# Altium project AMC_FMC_Carrier v2.PrjPcb (part 8 of 9)

## Sheet JTAG_Configuration.SchDoc
size A4; DocumentNumber: 8; SheetNumber: 8; SheetTotal: 30
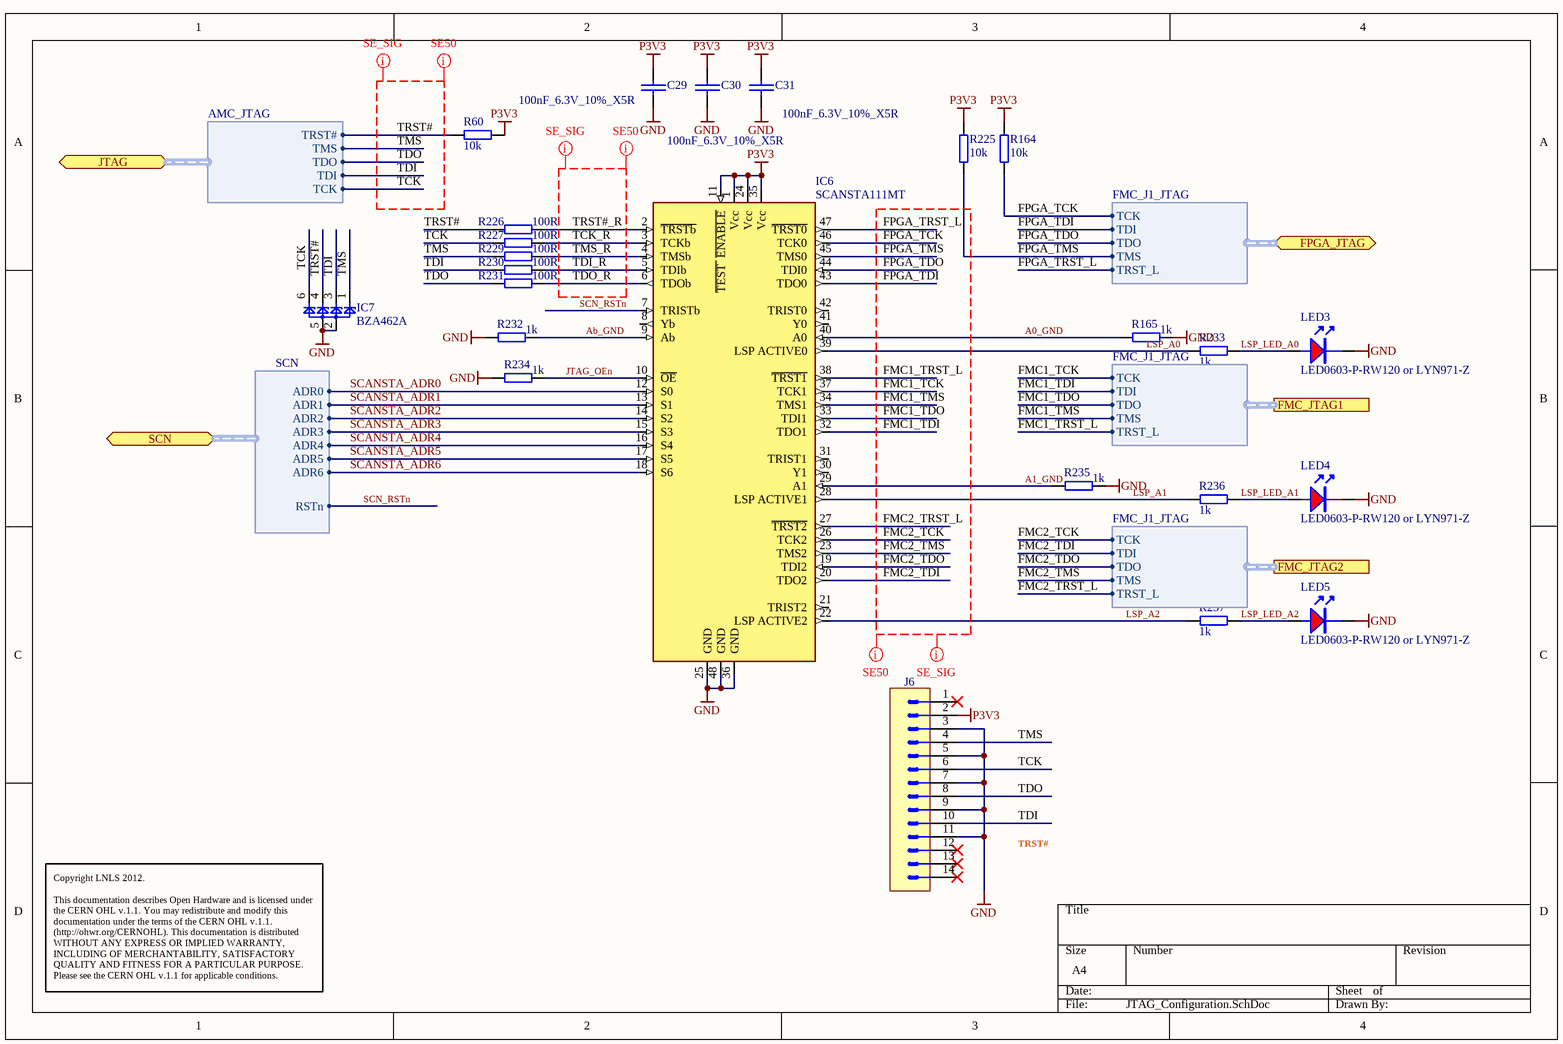
[diagram p16: JTAG_Configuration.SchDoc]

### Parts
C29  100nF_6.3V_10%_X5R  [0201C]
C30  100nF_6.3V_10%_X5R  [0201C]
C31  100nF_6.3V_10%_X5R  [0201C]
IC6  SCANSTA111MT  [TSSOP-48]
IC7  BZA462A  [SOT23-6]
J6  BHMT14S  [BHMT14S]  (value not drawn)
LED3  LED0603-P-RW120 or LYN971-Z  [led_0603R]
LED4  LED0603-P-RW120 or LYN971-Z  [led_0603R]
LED5  LED0603-P-RW120 or LYN971-Z  [led_0603R]
R60  10k  [0402R]
R164  10k  [0402R]
R165  1k  [0402R]
R225  10k  [0402R]
R226  100R  [0402R]
R227  100R  [0402R]
R229  100R  [0402R]
R230  100R  [0402R]
R231  100R  [0402R]
R232  1k  [0402R]
R233  1k  [0402R]
R234  1k  [0402R]
R235  1k  [0402R]
R236  1k  [0402R]
R237  1k  [0402R]

### Ports
FMC_JTAG1 (harness FMC_J1_JTAG), FMC_JTAG2 (harness FMC_J1_JTAG), FPGA_JTAG (harness FMC_J1_JTAG), JTAG (harness AMC_JTAG), SCN (harness SCN)

### Harnesses
FMC_J1_JTAG: TCK, TDI, TDO, TMS, TRST_L
AMC_JTAG: TCK, TDI, TDO, TMS, TRST#
SCN: ADR0, ADR1, ADR2, ADR3, ADR4, ADR5, ADR6, RSTn

### Nets
GND: C29.2 C30.2 C31.2 IC6.25(GND) IC6.36(GND) IC6.48(GND) IC7.2 IC7.5 J6.3 J6.5 J6.7 J6.9 J6.11 LED3.K LED4.K LED5.K R165.2 R232.1 R234.1 R235.2
P3V3: C29.1 C30.1 C31.1 IC6.1(Vcc) IC6.11(~{TEST_}_~{ENABLE}) IC6.24(Vcc) IC6.35(Vcc) J6.2 R60.1 R164.2 R225.2
A0_GND: IC6.40(A0) R165.1
A1_GND: IC6.29(A1) R235.1
Ab_GND: IC6.9(Ab) R232.2
FMC1_TCK: IC6.37(TCK1) ; port FMC_JTAG1.TCK  [project net JTAG1.TCK]
FMC1_TDI: IC6.32(TDO1) ; port FMC_JTAG1.TDI  [project net JTAG1.TDI]
FMC1_TDO: IC6.33(TDI1) ; port FMC_JTAG1.TDO  [project net JTAG1.TDO]
FMC1_TMS: IC6.34(TMS1) ; port FMC_JTAG1.TMS  [project net JTAG1.TMS]
FMC1_TRST_L: IC6.38(~{TRST1}) ; port FMC_JTAG1.TRST_L  [project net JTAG1.TRST_L]
FMC2_TCK: IC6.26(TCK2) ; port FMC_JTAG2.TCK  [project net JTAG2.TCK]
FMC2_TDI: IC6.20(TDO2) ; port FMC_JTAG2.TDI  [project net JTAG2.TDI]
FMC2_TDO: IC6.19(TDI2) ; port FMC_JTAG2.TDO  [project net JTAG2.TDO]
FMC2_TMS: IC6.23(TMS2) ; port FMC_JTAG2.TMS  [project net JTAG2.TMS]
FMC2_TRST_L: IC6.27(~{TRST2}) ; port FMC_JTAG2.TRST_L  [project net JTAG2.TRST_L]
FPGA_TCK: IC6.46(TCK0) R164.1 ; port FPGA_JTAG.TCK  [project net FJTAG.TCK]
FPGA_TDI: IC6.43(TDO0) ; port FPGA_JTAG.TDI  [project net FJTAG.TDI]
FPGA_TDO: IC6.44(TDI0) ; port FPGA_JTAG.TDO  [project net FJTAG.TDO]
FPGA_TMS: IC6.45(TMS0) R225.1 ; port FPGA_JTAG.TMS  [project net FJTAG.TMS]
FPGA_TRST_L: IC6.47(~{TRST0}) ; port FPGA_JTAG.TRST_L  [project net FJTAG.TRST_L]
JTAG_OEn: IC6.10(~{OE}) R234.2
LSP_A0: IC6.39(LSP_ACTIVE0) R233.1
LSP_A1: IC6.28(LSP_ACTIVE1) R236.1
LSP_A2: IC6.22(LSP_ACTIVE2) R237.1
LSP_LED_A0: LED3.A R233.2
LSP_LED_A1: LED4.A R236.2
LSP_LED_A2: LED5.A R237.2
SCANSTA_ADR0: IC6.12(S0) ; port SCN.ADR0  [project net SCN.ADR0]
SCANSTA_ADR1: IC6.13(S1) ; port SCN.ADR1  [project net SCN.ADR1]
SCANSTA_ADR2: IC6.14(S2) ; port SCN.ADR2  [project net SCN.ADR2]
SCANSTA_ADR3: IC6.15(S3) ; port SCN.ADR3  [project net SCN.ADR3]
SCANSTA_ADR4: IC6.16(S4) ; port SCN.ADR4  [project net SCN.ADR4]
SCANSTA_ADR5: IC6.17(S5) ; port SCN.ADR5  [project net SCN.ADR5]
SCANSTA_ADR6: IC6.18(S6) ; port SCN.ADR6  [project net SCN.ADR6]
SCN_RSTn: IC6.7(TRISTb) ; port SCN.RSTn  [project net SCN.RSTn]
TCK: IC7.6 J6.6 R227.1 ; port JTAG.TCK  [project net AJTAG.TCK]
TCK_R: IC6.3(TCKb) R227.2
TDI: IC7.3 J6.10 R230.1 ; port JTAG.TDI  [project net AJTAG.TDI]
TDI_R: IC6.5(TDIb) R230.2
TDO: J6.8 R231.1 ; port JTAG.TDO  [project net AJTAG.TDO]
TDO_R: IC6.6(TDOb) R231.2
TMS: IC7.1 J6.4 R229.1 ; port JTAG.TMS  [project net AJTAG.TMS]
TMS_R: IC6.4(TMSb) R229.2
TRST#: IC7.4 R60.2 R226.1 ; port JTAG.TRST#  [project net AJTAG.TRST#]
TRST#_R: IC6.2(~{TRSTb}) R226.2

Not connected (* = marked no-connect by the designer): IC6 8(Yb) 21(TRIST2) 30(Y1) 31(TRIST1) 41(Y0) 42(TRIST0); J6 1* 12* 13* 14*

### Layout directives
net class SE_SIG: FMC1_TCK, FMC1_TDI, FMC1_TDO, FMC1_TMS, FMC1_TRST_L, FMC2_TCK, FMC2_TDI, FMC2_TDO, FMC2_TMS, FMC2_TRST_L, FPGA_TCK, FPGA_TDI, FPGA_TDO, FPGA_TMS, FPGA_TRST_L, TCK, TCK_R, TDI, TDI_R, TDO, TDO_R, TMS, TMS_R, TRST#, TRST#_R
net class SE50: FMC1_TCK, FMC1_TDI, FMC1_TDO, FMC1_TMS, FMC1_TRST_L, FMC2_TCK, FMC2_TDI, FMC2_TDO, FMC2_TMS, FMC2_TRST_L, FPGA_TCK, FPGA_TDI, FPGA_TDO, FPGA_TMS, FPGA_TRST_L, TCK, TCK_R, TDI, TDI_R, TDO, TDO_R, TMS, TMS_R, TRST#, TRST#_R

### Notes on the sheet
- TRST#
- Copyright LNLS 2012.
  This documentation describes Open Hardware and is licensed under the CERN OHL v.1.1. You may redistribute and modify this documentation under the terms of the CERN OHL v.1.1. (http://ohwr.org/CERNOHL). This documentation is distributed WITHOUT ANY EXPRESS OR IMPLIED WARRANTY, INCLUDING OF MERCHANTABILITY, SATISFACTORY QUALITY AND FITNESS FOR A PARTICULAR PURPOSE. Please see the CERN OHL v.1.1 for applicable conditions.

### Library data of the parts
C29-C31 = CAP_SMD_0201: Capacitor SMD
IC6 = IFC_SCANSTA111: Enhanced SCAN Bridge Multidrop Addressable IEEE 1149.1 (JTAG) Port; Supplier 1: Digi-Key; Supplier Part Number 1: SCANSTA111MT-ND
IC7 = D_TVS_BZA462A: Quadruple 4V ESD transient voltage suppressor; Supplier 1: Newark; Supplier Part Number 1: 79R1868
J6 = MOLEX_87831-1420: Connector 14 Male; Part Description: 2.00mm (.079") Pitch Milli-Grid™ Header, Vertical, Shrouded, Center Polarization Slot, Locking Window, 14 Circuits; Part Number: BHMT14S; Component Kind: Standard; Component Type: Standard; Pin Count: 14; Family: Milli-Grid™; Mounted: Yes; Socket: No; SMD: No; Status: None; Manufacturer Part Number: BHMT14S; ComponentHeight: 6.4mm; Author: CERN DEM JLC; CreateDate: 2010-04-13; LatestRevisionDate: 2010-04-13
LED3-LED5 = LED_0603R: LED 0603 red; Supplier 1: Newark; Supplier Part Number 1: 22M3004
R60 R164 R165 R225-R227 R229-R237 = RES_0402: SMD Resistor; Supplier 1: Newark; Supplier Part Number 1: 59M6691

## Sheet RTM_CON.SchDoc
size A3; DocumentNumber: 21; SheetNumber: 21; SheetTotal: 30
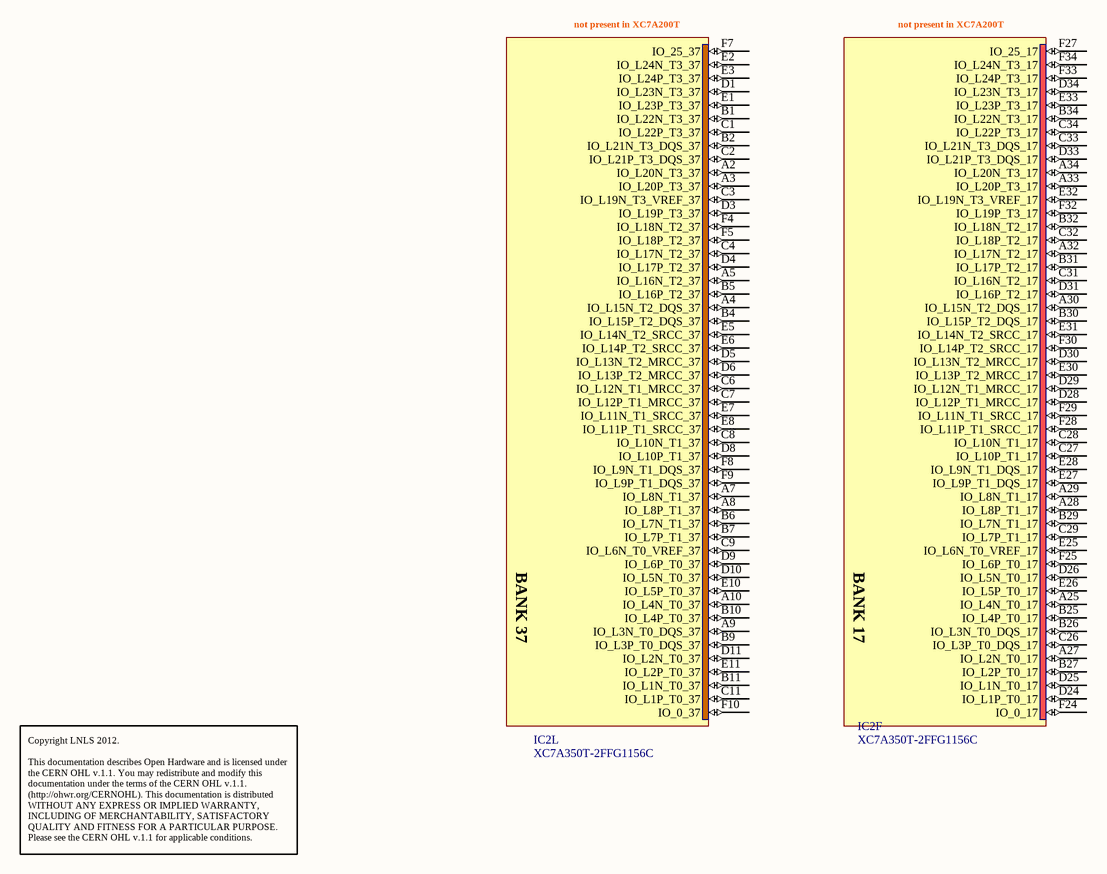
[diagram p17: RTM_CON.SchDoc]

### Parts
IC2  XC7A350T-2FFG1156C  [BGA1156C100P34X34_3500X3500X335]  (parts F,L of 23)

### Nets

Not connected (* = marked no-connect by the designer): IC2 A2(IO_L20N_T3_37) A3(IO_L20P_T3_37) A4(IO_L15N_T2_DQS_37) A5(IO_L16N_T2_37) A7(IO_L8N_T1_37) A8(IO_L8P_T1_37) A9(IO_L3N_T0_DQS_37) A10(IO_L4N_T0_37) A25(IO_L4N_T0_17) A27(IO_L2N_T0_17) A28(IO_L8P_T1_17) A29(IO_L8N_T1_17) A30(IO_L15N_T2_DQS_17) A32(IO_L17N_T2_17) A33(IO_L20P_T3_17) A34(IO_L20N_T3_17) B1(IO_L22N_T3_37) B2(IO_L21N_T3_DQS_37) B4(IO_L15P_T2_DQS_37) B5(IO_L16P_T2_37) B6(IO_L7N_T1_37) B7(IO_L7P_T1_37) B9(IO_L3P_T0_DQS_37) B10(IO_L4P_T0_37) B11(IO_L1N_T0_37) B25(IO_L4P_T0_17) B26(IO_L3N_T0_DQS_17) B27(IO_L2P_T0_17) B29(IO_L7N_T1_17) B30(IO_L15P_T2_DQS_17) B31(IO_L17P_T2_17) B32(IO_L18N_T2_17) B34(IO_L22N_T3_17) C1(IO_L22P_T3_37) C2(IO_L21P_T3_DQS_37) C3(IO_L19N_T3_VREF_37) C4(IO_L17N_T2_37) C6(IO_L12N_T1_MRCC_37) C7(IO_L12P_T1_MRCC_37) C8(IO_L10N_T1_37) C9(IO_L6N_T0_VREF_37) C11(IO_L1P_T0_37) C26(IO_L3P_T0_DQS_17) C27(IO_L10P_T1_17) C28(IO_L10N_T1_17) C29(IO_L7P_T1_17) C31(IO_L16N_T2_17) C32(IO_L18P_T2_17) C33(IO_L21N_T3_DQS_17) C34(IO_L22P_T3_17) D1(IO_L23N_T3_37) D3(IO_L19P_T3_37) D4(IO_L17P_T2_37) D5(IO_L13N_T2_MRCC_37) D6(IO_L13P_T2_MRCC_37) D8(IO_L10P_T1_37) D9(IO_L6P_T0_37) D10(IO_L5N_T0_37) D11(IO_L2N_T0_37) D24(IO_L1P_T0_17) D25(IO_L1N_T0_17) D26(IO_L5N_T0_17) D28(IO_L12P_T1_MRCC_17) D29(IO_L12N_T1_MRCC_17) D30(IO_L13N_T2_MRCC_17) D31(IO_L16P_T2_17) D33(IO_L21P_T3_DQS_17) D34(IO_L23N_T3_17) E1(IO_L23P_T3_37) E2(IO_L24N_T3_37) E3(IO_L24P_T3_37) E5(IO_L14N_T2_SRCC_37) E6(IO_L14P_T2_SRCC_37) E7(IO_L11N_T1_SRCC_37) E8(IO_L11P_T1_SRCC_37) E10(IO_L5P_T0_37) E11(IO_L2P_T0_37) E25(IO_L6N_T0_VREF_17) E26(IO_L5P_T0_17) E27(IO_L9P_T1_DQS_17) E28(IO_L9N_T1_DQS_17) E30(IO_L13P_T2_MRCC_17) E31(IO_L14N_T2_SRCC_17) E32(IO_L19N_T3_VREF_17) E33(IO_L23P_T3_17) F4(IO_L18N_T2_37) F5(IO_L18P_T2_37) F7(IO_25_37) F8(IO_L9N_T1_DQS_37) F9(IO_L9P_T1_DQS_37) F10(IO_0_37) F24(IO_0_17) F25(IO_L6P_T0_17) F27(IO_25_17) F28(IO_L11P_T1_SRCC_17) F29(IO_L11N_T1_SRCC_17) F30(IO_L14P_T2_SRCC_17) F32(IO_L19P_T3_17) F33(IO_L24P_T3_17) F34(IO_L24N_T3_17)

### Notes on the sheet
- (near IC2) not present in XC7A200T
- Copyright LNLS 2012.
  This documentation describes Open Hardware and is licensed under the CERN OHL v.1.1. You may redistribute and modify this documentation under the terms of the CERN OHL v.1.1. (http://ohwr.org/CERNOHL). This documentation is distributed WITHOUT ANY EXPRESS OR IMPLIED WARRANTY, INCLUDING OF MERCHANTABILITY, SATISFACTORY QUALITY AND FITNESS FOR A PARTICULAR PURPOSE. Please see the CERN OHL v.1.1 for applicable conditions.
- (in symbol XC7A350T-2FFG1156C, part F) BANK 17
- (in symbol XC7A350T-2FFG1156C, part L) BANK 37

### Library data of the parts
IC2 = XC7A350T-2FFG1156C: Artix-6 FPGA, 16 GTPs, 600 User I/Os, 1156-Pin BGA, Speed Grade 2, Commercial Grade, Pb-Free; Part Description: Artix-7 FPGA, 16 GTPs, 600 User I/Os, 1156-Pin BGA, Speed Grade 2, Commercial Grade, Pb-Free; Manufacturer: XILINX; Table: Logic; Part Number: XC7A350T-2FFG1156C; Component Kind: Standard; Component Type: Standard; Device: XC7A350T-2FFG1156C; PackageDescription: BGA, 1.00mm Pitch, Square; 1156 Pin, 34 Columns X 34 Rows, 35.00mm X 35.00mm X 3.350mm H; Manufacturer Part Number: XC7A350T-2FFG1156C; Pin Count: 1156; Case: BGA1156; Mounted: Yes; Socket: No; SMD: Yes; ComponentHeight: 3.35mm; HelpURL: \\cern.ch\dfs\Applications\Altium\Datasheets\XC7A350T-2FFG1156C.pdf; ComponentLink1URL: \\cern.ch\dfs\Applications\Altium\Datasheets\XC7A350T-2FFG1156C.pdf; ComponentLink1Description: Package/Pinout; Author: CERN DEM JLC; CreateDate: 2012-09-19; LatestRevisionDate: 2012-09-19

## Sheet M-LVDS PHY.SchDoc
size A4; DocumentNumber: 22; SheetNumber: 22; SheetTotal: 30
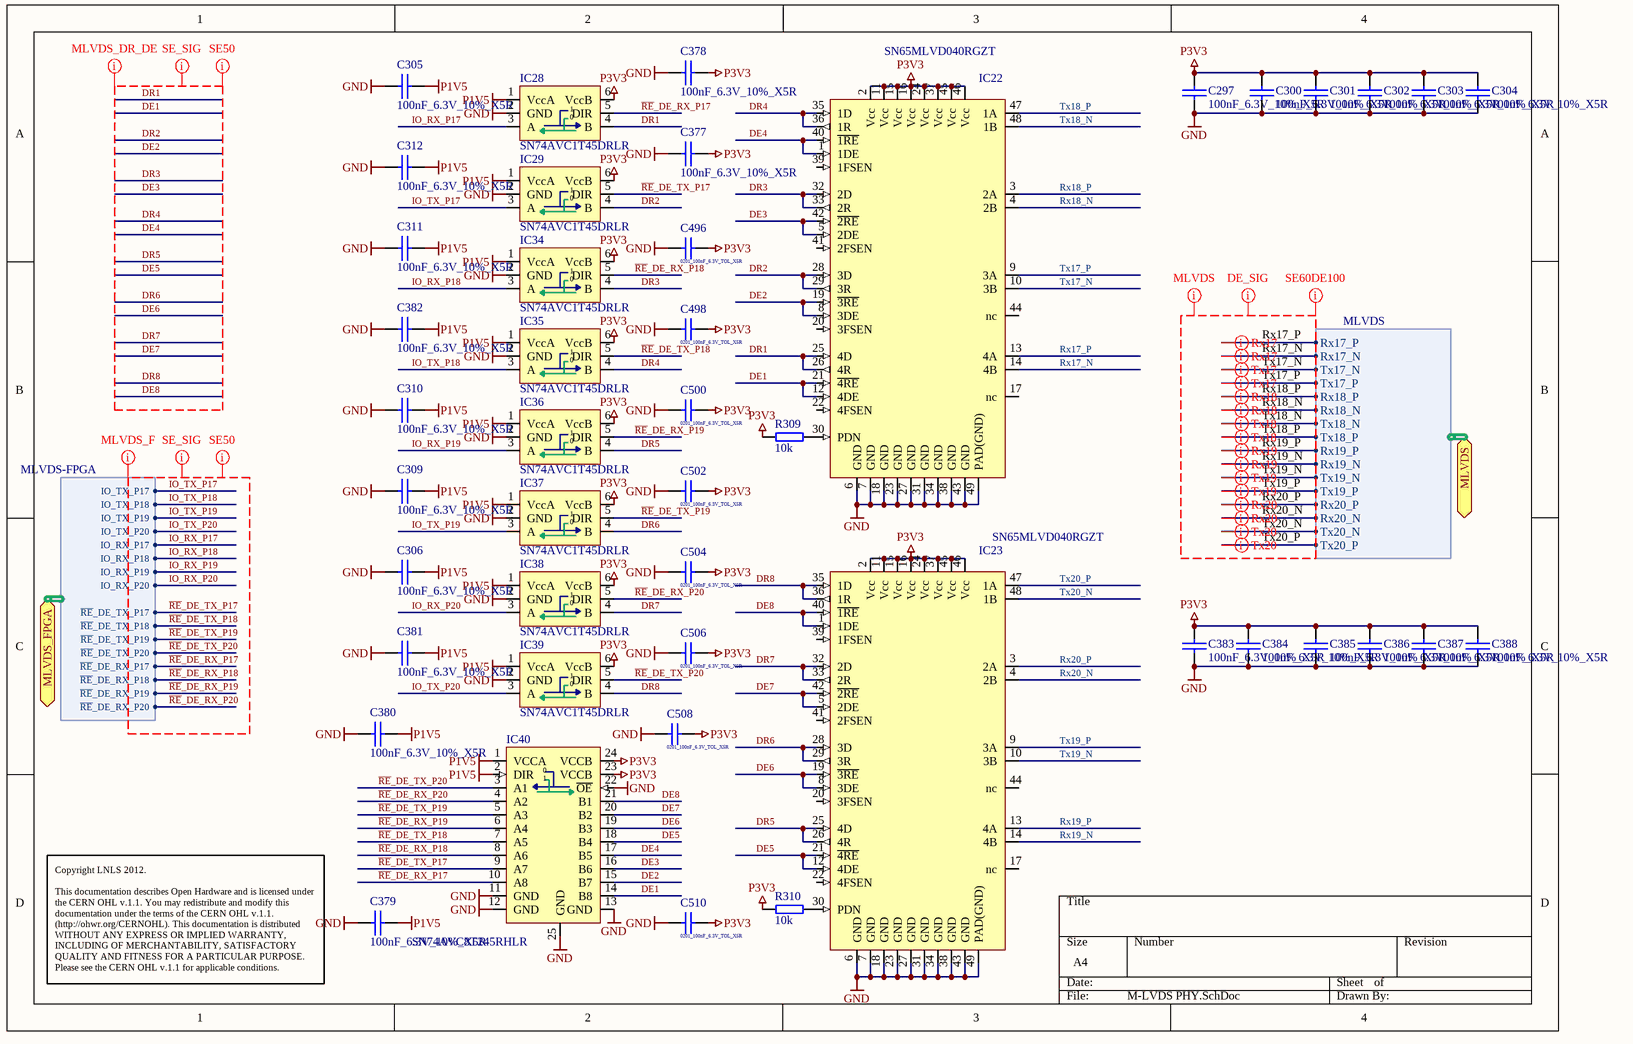
[diagram p18: M-LVDS PHY.SchDoc]

### Parts
C297  100nF_6.3V_10%_X5R  [0201C]
C300  100nF_6.3V_10%_X5R  [0201C]
C301  100nF_6.3V_10%_X5R  [0201C]
C302  100nF_6.3V_10%_X5R  [0201C]
C303  100nF_6.3V_10%_X5R  [0201C]
C304  100nF_6.3V_10%_X5R  [0201C]
C305  100nF_6.3V_10%_X5R  [0201C]
C306  100nF_6.3V_10%_X5R  [0201C]
C309  100nF_6.3V_10%_X5R  [0201C]
C310  100nF_6.3V_10%_X5R  [0201C]
C311  100nF_6.3V_10%_X5R  [0201C]
C312  100nF_6.3V_10%_X5R  [0201C]
C377  100nF_6.3V_10%_X5R  [0201C]
C378  100nF_6.3V_10%_X5R  [0201C]
C379  100nF_6.3V_10%_X5R  [0201C]
C380  100nF_6.3V_10%_X5R  [0201C]
C381  100nF_6.3V_10%_X5R  [0201C]
C382  100nF_6.3V_10%_X5R  [0201C]
C383  100nF_6.3V_10%_X5R  [0201C]
C384  100nF_6.3V_10%_X5R  [0201C]
C385  100nF_6.3V_10%_X5R  [0201C]
C386  100nF_6.3V_10%_X5R  [0201C]
C387  100nF_6.3V_10%_X5R  [0201C]
C388  100nF_6.3V_10%_X5R  [0201C]
C496  0201_100nF_6.3V_TOL_X5R  [CAPC0603X33N]
C498  0201_100nF_6.3V_TOL_X5R  [CAPC0603X33N]
C500  0201_100nF_6.3V_TOL_X5R  [CAPC0603X33N]
C502  0201_100nF_6.3V_TOL_X5R  [CAPC0603X33N]
C504  0201_100nF_6.3V_TOL_X5R  [CAPC0603X33N]
C506  0201_100nF_6.3V_TOL_X5R  [CAPC0603X33N]
C508  0201_100nF_6.3V_TOL_X5R  [CAPC0603X33N]
C510  0201_100nF_6.3V_TOL_X5R  [CAPC0603X33N]
IC22  SN65MLVD040RGZT  [QFN48L]
IC23  SN65MLVD040RGZT  [QFN48L]
IC28  SN74AVC1T45DRLR  [SOT-553]
IC29  SN74AVC1T45DRLR  [SOT-553]
IC34  SN74AVC1T45DRLR  [SOT-553]
IC35  SN74AVC1T45DRLR  [SOT-553]
IC36  SN74AVC1T45DRLR  [SOT-553]
IC37  SN74AVC1T45DRLR  [SOT-553]
IC38  SN74AVC1T45DRLR  [SOT-553]
IC39  SN74AVC1T45DRLR  [SOT-553]
IC40  SN74AVC8T245RHLR  [QFN50P350X550X100-24N]
R309  10k  [0402R]
R310  10k  [0402R]

### Ports
MLVDS (harness MLVDS), MLVDS_FPGA (harness MLVDS-FPGA)

### Harnesses
MLVDS: Rx17_P, Rx17_N, Tx17_N, Tx17_P, Rx18_P, Rx18_N, Tx18_N, Tx18_P, Rx19_P, Rx19_N, Tx19_N, Tx19_P, Rx20_P, Rx20_N, Tx20_N, Tx20_P
MLVDS-FPGA: IO_TX_P17, IO_TX_P18, IO_TX_P19, IO_TX_P20, IO_RX_P17, IO_RX_P18, IO_RX_P19, IO_RX_P20, ~{RE}_DE_TX_P17, ~{RE}_DE_TX_P18, ~{RE}_DE_TX_P19, ~{RE}_DE_TX_P20, ~{RE}_DE_RX_P17, ~{RE}_DE_RX_P18, ~{RE}_DE_RX_P19, ~{RE}_DE_RX_P20

### Nets
GND: C297.2 C300.2 C301.2 C302.2 C303.2 C304.2 C305.2 C306.1 C309.1 C310.1 C311.1 C312.1 C377.1 C378.1 C379.1 C380.1 C381.1 C382.1 C383.2 C384.2 C385.2 C386.2 C387.2 C388.2 C496.2 C498.2 C500.2 C502.2 C504.2 C506.2 C508.2 C510.2 IC22.6(GND) IC22.7(GND) IC22.18(GND) IC22.23(GND) IC22.27(GND) IC22.31(GND) IC22.34(GND) IC22.38(GND) IC22.43(GND) IC22.49(PAD(GND)) IC23.6(GND) IC23.7(GND) IC23.18(GND) IC23.23(GND) IC23.27(GND) IC23.31(GND) IC23.34(GND) IC23.38(GND) IC23.43(GND) IC23.49(PAD(GND)) IC28.2(GND) IC29.2(GND) IC34.2(GND) IC35.2(GND) IC36.2(GND) IC37.2(GND) IC38.2(GND) IC39.2(GND) IC40.11(GND) IC40.12(GND) IC40.13(GND) IC40.22(~{OE}) IC40.25(GND)
P1V5: C305.1 C306.2 C309.2 C310.2 C311.2 C312.2 C379.2 C380.2 C381.2 C382.2 IC28.1(VccA) IC29.1(VccA) IC34.1(VccA) IC35.1(VccA) IC36.1(VccA) IC37.1(VccA) IC38.1(VccA) IC39.1(VccA) IC40.1(VCCA) IC40.2(DIR)
P3V3: C297.1 C300.1 C301.1 C302.1 C303.1 C304.1 C377.2 C378.2 C383.1 C384.1 C385.1 C386.1 C387.1 C388.1 C496.1 C498.1 C500.1 C502.1 C504.1 C506.1 C508.1 C510.1 IC22.2(Vcc) IC22.11(Vcc) IC22.15(Vcc) IC22.16(Vcc) IC22.24(Vcc) IC22.37(Vcc) IC22.45(Vcc) IC22.46(Vcc) IC23.2(Vcc) IC23.11(Vcc) IC23.15(Vcc) IC23.16(Vcc) IC23.24(Vcc) IC23.37(Vcc) IC23.45(Vcc) IC23.46(Vcc) IC28.6(VccB) IC29.6(VccB) IC34.6(VccB) IC35.6(VccB) IC36.6(VccB) IC37.6(VccB) IC38.6(VccB) IC39.6(VccB) IC40.23(VCCB) IC40.24(VCCB) R309.1 R310.1
DE1: IC22.12(4DE) IC22.21(~{4RE}) IC40.14(B8)
DE2: IC22.8(3DE) IC22.19(~{3RE}) IC40.15(B7)
DE3: IC22.5(2DE) IC22.42(~{2RE}) IC40.16(B6)
DE4: IC22.1(1DE) IC22.40(~{1RE}) IC40.17(B5)
DE5: IC23.12(4DE) IC23.21(~{4RE}) IC40.18(B4)
DE6: IC23.8(3DE) IC23.19(~{3RE}) IC40.19(B3)
DE7: IC23.5(2DE) IC23.42(~{2RE}) IC40.20(B2)
DE8: IC23.1(1DE) IC23.40(~{1RE}) IC40.21(B1)
DR1: IC22.25(4D) IC22.26(4R) IC28.4(B)
DR2: IC22.28(3D) IC22.29(3R) IC29.4(B)
DR3: IC22.32(2D) IC22.33(2R) IC34.4(B)
DR4: IC22.35(1D) IC22.36(1R) IC35.4(B)
DR5: IC23.25(4D) IC23.26(4R) IC36.4(B)
DR6: IC23.28(3D) IC23.29(3R) IC37.4(B)
DR7: IC23.32(2D) IC23.33(2R) IC38.4(B)
DR8: IC23.35(1D) IC23.36(1R) IC39.4(B)
IO_RX_P17: IC28.3(A) ; port MLVDS_FPGA.IO_RX_P17  [project net MLVDS_F.IO_RX_P17]
IO_RX_P18: IC34.3(A) ; port MLVDS_FPGA.IO_RX_P18  [project net MLVDS_F.IO_RX_P18]
IO_RX_P19: IC36.3(A) ; port MLVDS_FPGA.IO_RX_P19  [project net MLVDS_F.IO_RX_P19]
IO_RX_P20: IC38.3(A) ; port MLVDS_FPGA.IO_RX_P20  [project net MLVDS_F.IO_RX_P20]
IO_TX_P17: IC29.3(A) ; port MLVDS_FPGA.IO_TX_P17  [project net MLVDS_F.IO_TX_P17]
IO_TX_P18: IC35.3(A) ; port MLVDS_FPGA.IO_TX_P18  [project net MLVDS_F.IO_TX_P18]
IO_TX_P19: IC37.3(A) ; port MLVDS_FPGA.IO_TX_P19  [project net MLVDS_F.IO_TX_P19]
IO_TX_P20: IC39.3(A) ; port MLVDS_FPGA.IO_TX_P20  [project net MLVDS_F.IO_TX_P20]
~{RE}_DE_RX_P17: IC28.5(DIR) IC40.10(A8) ; port MLVDS_FPGA.~{RE}_DE_RX_P17  [project net MLVDS_F.~{RE}_DE_RX_P17]
~{RE}_DE_RX_P18: IC34.5(DIR) IC40.8(A6) ; port MLVDS_FPGA.~{RE}_DE_RX_P18  [project net MLVDS_F.~{RE}_DE_RX_P18]
~{RE}_DE_RX_P19: IC36.5(DIR) IC40.6(A4) ; port MLVDS_FPGA.~{RE}_DE_RX_P19  [project net MLVDS_F.~{RE}_DE_RX_P19]
~{RE}_DE_RX_P20: IC38.5(DIR) IC40.4(A2) ; port MLVDS_FPGA.~{RE}_DE_RX_P20  [project net MLVDS_F.~{RE}_DE_RX_P20]
~{RE}_DE_TX_P17: IC29.5(DIR) IC40.9(A7) ; port MLVDS_FPGA.~{RE}_DE_TX_P17  [project net MLVDS_F.~{RE}_DE_TX_P17]
~{RE}_DE_TX_P18: IC35.5(DIR) IC40.7(A5) ; port MLVDS_FPGA.~{RE}_DE_TX_P18  [project net MLVDS_F.~{RE}_DE_TX_P18]
~{RE}_DE_TX_P19: IC37.5(DIR) IC40.5(A3) ; port MLVDS_FPGA.~{RE}_DE_TX_P19  [project net MLVDS_F.~{RE}_DE_TX_P19]
~{RE}_DE_TX_P20: IC39.5(DIR) IC40.3(A1) ; port MLVDS_FPGA.~{RE}_DE_TX_P20  [project net MLVDS_F.~{RE}_DE_TX_P20]
Rx17_N: IC22.14(4B) ; port MLVDS.Rx17_N  [project net MLVDS_A.Rx17_N]
Rx17_P: IC22.13(4A) ; port MLVDS.Rx17_P  [project net MLVDS_A.Rx17_P]
Rx18_N: IC22.4(2B) ; port MLVDS.Rx18_N  [project net MLVDS_A.Rx18_N]
Rx18_P: IC22.3(2A) ; port MLVDS.Rx18_P  [project net MLVDS_A.Rx18_P]
Rx19_N: IC23.14(4B) ; port MLVDS.Rx19_N  [project net MLVDS_A.Rx19_N]
Rx19_P: IC23.13(4A) ; port MLVDS.Rx19_P  [project net MLVDS_A.Rx19_P]
Rx20_N: IC23.4(2B) ; port MLVDS.Rx20_N  [project net MLVDS_A.Rx20_N]
Rx20_P: IC23.3(2A) ; port MLVDS.Rx20_P  [project net MLVDS_A.Rx20_P]
Tx17_N: IC22.10(3B) ; port MLVDS.Tx17_N  [project net MLVDS_A.Tx17_N]
Tx17_P: IC22.9(3A) ; port MLVDS.Tx17_P  [project net MLVDS_A.Tx17_P]
Tx18_N: IC22.48(1B) ; port MLVDS.Tx18_N  [project net MLVDS_A.Tx18_N]
Tx18_P: IC22.47(1A) ; port MLVDS.Tx18_P  [project net MLVDS_A.Tx18_P]
Tx19_N: IC23.10(3B) ; port MLVDS.Tx19_N  [project net MLVDS_A.Tx19_N]
Tx19_P: IC23.9(3A) ; port MLVDS.Tx19_P  [project net MLVDS_A.Tx19_P]
Tx20_N: IC23.48(1B) ; port MLVDS.Tx20_N  [project net MLVDS_A.Tx20_N]
Tx20_P: IC23.47(1A) ; port MLVDS.Tx20_P  [project net MLVDS_A.Tx20_P]
NetIC22_30: IC22.30(PDN) R309.2
NetIC23_30: IC23.30(PDN) R310.2

Not connected (* = marked no-connect by the designer): IC22 17(nc) 20(3FSEN) 22(4FSEN) 39(1FSEN) 41(2FSEN) 44(nc); IC23 17(nc) 20(3FSEN) 22(4FSEN) 39(1FSEN) 41(2FSEN) 44(nc)

### Layout directives
differential pair: MLVDS_A.Rx17_N, MLVDS_A.Rx17_P, MLVDS_A.Rx18_N, MLVDS_A.Rx18_P, MLVDS_A.Rx19_N, MLVDS_A.Rx19_P, MLVDS_A.Rx20_N, MLVDS_A.Rx20_P, MLVDS_A.Tx17_N, MLVDS_A.Tx17_P, MLVDS_A.Tx18_N, MLVDS_A.Tx18_P, MLVDS_A.Tx19_N, MLVDS_A.Tx19_P, MLVDS_A.Tx20_N, MLVDS_A.Tx20_P
net class MLVDS: Rx17_N, Rx17_P, Rx18_N, Rx18_P, Rx19_N, Rx19_P, Rx20_N, Rx20_P, Tx17_N, Tx17_P, Tx18_N, Tx18_P, Tx19_N, Tx19_P, Tx20_N, Tx20_P
net class DE_SIG: Rx17_N, Rx17_P, Rx18_N, Rx18_P, Rx19_N, Rx19_P, Rx20_N, Rx20_P, Tx17_N, Tx17_P, Tx18_N, Tx18_P, Tx19_N, Tx19_P, Tx20_N, Tx20_P
net class SE60DE100: Rx17_N, Rx17_P, Rx18_N, Rx18_P, Rx19_N, Rx19_P, Rx20_N, Rx20_P, Tx17_N, Tx17_P, Tx18_N, Tx18_P, Tx19_N, Tx19_P, Tx20_N, Tx20_P
net class MLVDS_F: IO_RX_P17, IO_RX_P18, IO_RX_P19, IO_RX_P20, IO_TX_P17, IO_TX_P18, IO_TX_P19, IO_TX_P20, ~{RE}_DE_RX_P17, ~{RE}_DE_RX_P18, ~{RE}_DE_RX_P19, ~{RE}_DE_RX_P20, ~{RE}_DE_TX_P17, ~{RE}_DE_TX_P18, ~{RE}_DE_TX_P19, ~{RE}_DE_TX_P20
net class SE50: DE1, DE2, DE3, DE4, DE5, DE6, DE7, DE8, DR1, DR2, DR3, DR4, DR5, DR6, DR7, DR8, IO_RX_P17, IO_RX_P18, IO_RX_P19, IO_RX_P20, IO_TX_P17, IO_TX_P18, IO_TX_P19, IO_TX_P20, ~{RE}_DE_RX_P17, ~{RE}_DE_RX_P18, ~{RE}_DE_RX_P19, ~{RE}_DE_RX_P20, ~{RE}_DE_TX_P17, ~{RE}_DE_TX_P18, ~{RE}_DE_TX_P19, ~{RE}_DE_TX_P20
net class SE_SIG: DE1, DE2, DE3, DE4, DE5, DE6, DE7, DE8, DR1, DR2, DR3, DR4, DR5, DR6, DR7, DR8, IO_RX_P17, IO_RX_P18, IO_RX_P19, IO_RX_P20, IO_TX_P17, IO_TX_P18, IO_TX_P19, IO_TX_P20, ~{RE}_DE_RX_P17, ~{RE}_DE_RX_P18, ~{RE}_DE_RX_P19, ~{RE}_DE_RX_P20, ~{RE}_DE_TX_P17, ~{RE}_DE_TX_P18, ~{RE}_DE_TX_P19, ~{RE}_DE_TX_P20
net class MLVDS_DR_DE: DE1, DE2, DE3, DE4, DE5, DE6, DE7, DE8, DR1, DR2, DR3, DR4, DR5, DR6, DR7, DR8

### Notes on the sheet
- Copyright LNLS 2012.
  This documentation describes Open Hardware and is licensed under the CERN OHL v.1.1. You may redistribute and modify this documentation under the terms of the CERN OHL v.1.1. (http://ohwr.org/CERNOHL). This documentation is distributed WITHOUT ANY EXPRESS OR IMPLIED WARRANTY, INCLUDING OF MERCHANTABILITY, SATISFACTORY QUALITY AND FITNESS FOR A PARTICULAR PURPOSE. Please see the CERN OHL v.1.1 for applicable conditions.
- (in symbol 74AVC1T45) 0
- (in symbol 74AVC8T245_QFN) 0

### Library data of the parts
C297 C300-C306 C309-C312 C377-C388 = CAP_SMD_0201: Capacitor SMD
C496 C498 C500 C502 C504 C506 C508 C510 = Ceramic_0201: MiscInfo: Biggest Cern Footprint [max height]; Document Name: M-LVDS PHY.SchDoc; Part Number: Ceramic_0201; FootprintSizeX (mm): 1.5; FootprintSizeY (mm): 0.7; FootprintRectangleArea (mm): 1.05; Thickness (Max) (mm): 0.33; FootprintAlias: 0201
IC22 IC23 = IFC_SN65MLVD040
IC28 IC29 IC34-IC39 = 74AVC1T45: 1-bit Transceiver Dual Supply (1.4...3.6V)
IC40 = 74AVC8T245_QFN: 8 channel bidir translator buffer (1.4..3.6V)
R309 R310 = RES_0402: SMD Resistor; Supplier 1: Newark; Supplier Part Number 1: 59M6691

## Sheet Clock_WR.SchDoc
size A3; DocumentNumber: 24; SheetNumber: 24; SheetTotal: 30
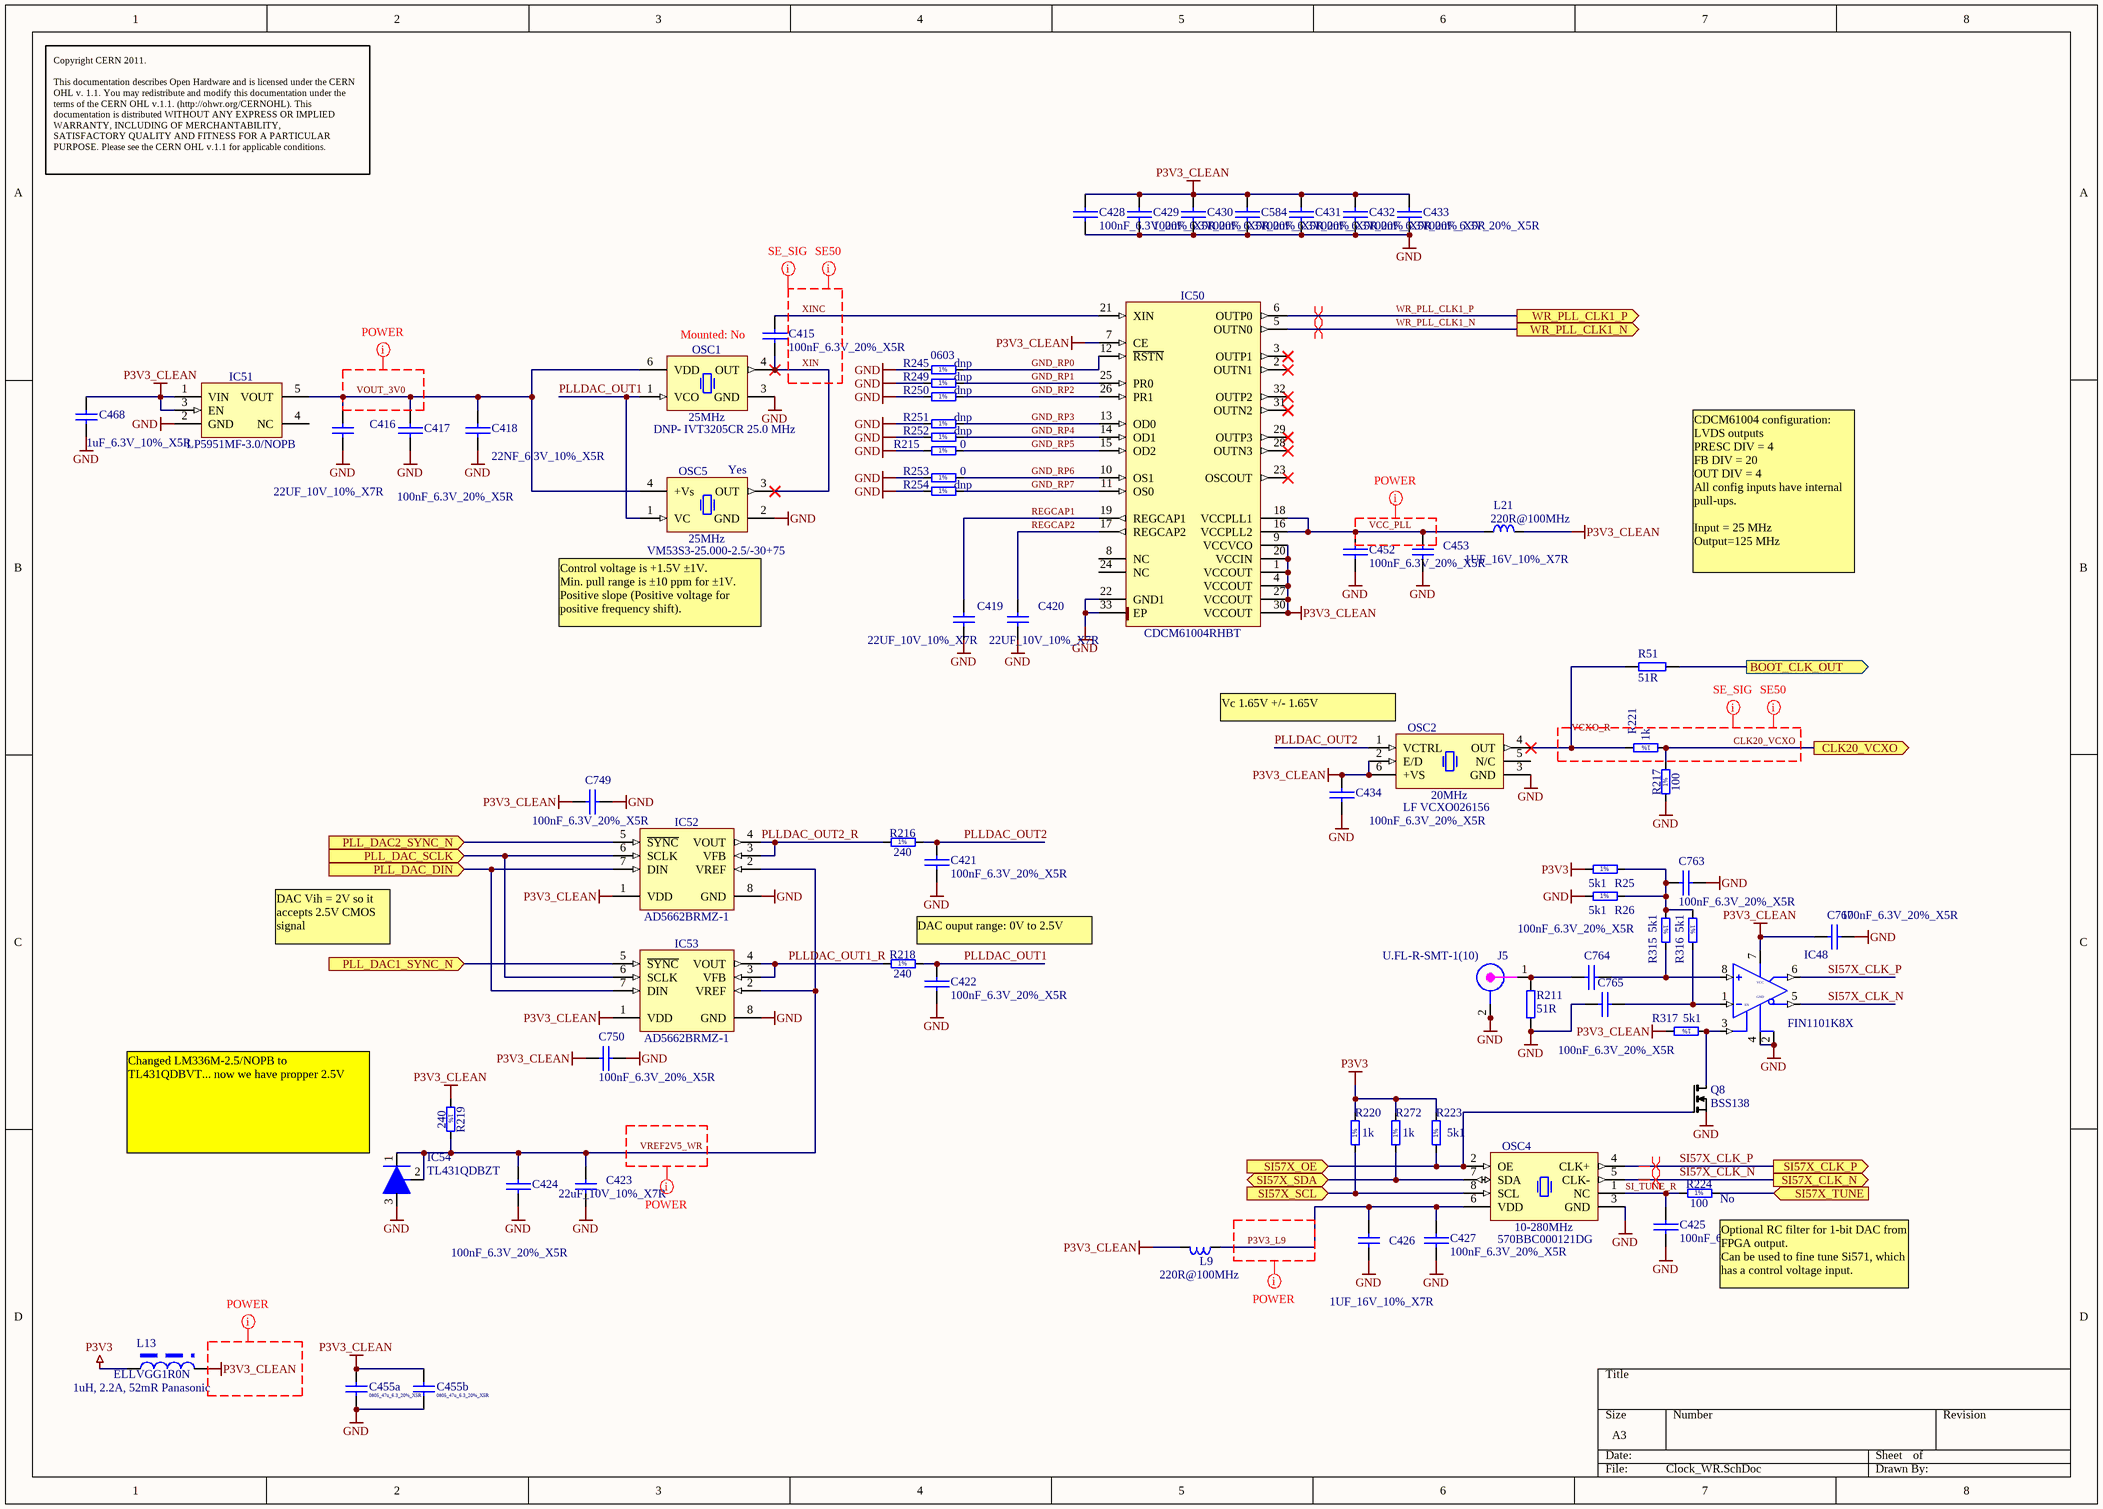
[diagram p19: Clock_WR.SchDoc]

### Parts
C415  100nF_6.3V_20%_X5R  [0201C]
C416  22UF_10V_10%_X7R  [CAPC1608X87N]
C417  100nF_6.3V_20%_X5R  [0201C]
C418  22NF_6.3V_10%_X5R  [0201C]
C419  22UF_10V_10%_X7R  [CAPC3216X180N]
C420  22UF_10V_10%_X7R  [CAPC3216X180N]
C421  100nF_6.3V_20%_X5R  [0201C]
C422  100nF_6.3V_20%_X5R  [0201C]
C423  22uF_10V_10%_X7R  [CAPC3216X180N]
C424  100nF_6.3V_20%_X5R  [0201C]
C425  100nF_6.3V_20%_X5R  [0201C]
C426  1UF_16V_10%_X7R  [CAPC1608X87N]
C427  100nF_6.3V_20%_X5R  [0201C]
C428  100nF_6.3V_20%_X5R  [0201C]
C429  100nF_6.3V_20%_X5R  [0201C]
C430  100nF_6.3V_20%_X5R  [0201C]
C431  100nF_6.3V_20%_X5R  [0201C]
C432  100nF_6.3V_20%_X5R  [0201C]
C433  100nF_6.3V_20%_X5R  [0201C]
C434  100nF_6.3V_20%_X5R  [0201C]
C452  100nF_6.3V_20%_X5R  [0201C]
C453  1UF_16V_10%_X7R  [CAPC1608X87N]
C455a  0805_47u_6.3_20%_X5R  [CAPC2012X140N]
C455b  0805_47u_6.3_20%_X5R  [CAPC2012X140N]
C468  1uF_6.3V_10%_X5R  [CAPC1608X87N]
C584  100nF_6.3V_20%_X5R  [0201C]
C749  100nF_6.3V_20%_X5R  [0201C]
C750  100nF_6.3V_20%_X5R  [0201C]
C763  100nF_6.3V_20%_X5R  [0201C]
C764  100nF_6.3V_20%_X5R  [0201C]
C765  100nF_6.3V_20%_X5R  [0201C]
C767  100nF_6.3V_20%_X5R  [0201C]
IC48  FIN1101K8X  [US8]
IC50  CDCM61004RHBT  [QFN50P500X500X100-33N-S355]
IC51  LP5951MF-3.0/NOPB  [SOT95P284X122-5N]
IC52  AD5662BRMZ-1  [SOP65P490X110-8N]
IC53  AD5662BRMZ-1  [SOP65P490X110-8N]
IC54  TL431QDBZT  [SOT-23]
J5  U.FL-R-SMT-1(10)  [CON_UFL_HIROSE_RECEPTACLE]
L9  220R@100MHz  [INDC2012X105N]
L13  ELLVGG1R0N  [L_ELLVGG2R2N]
L21  220R@100MHz  [INDC2012X105N]
OSC1  25MHz  Manufacturer Part Number: DNP- IVT3205CR 25.0 MHz  Mounted: No  [OSC_RAKON_IVT3200C]
OSC2  20MHz  Manufacturer Part Number: LF VCXO026156  [OSC_IQD_CFPV-45]
OSC4  10-280MHz  Manufacturer Part Number: 570BBC000121DG  [OSC_SILICON-LAB_SI570]
OSC5  25MHz  Manufacturer Part Number: VM53S3-25.000-2.5/-30+75  Mounted: Yes  [OSCCC320X500X160-4N]
Q8  BSS138  [SOT-23]
R25  5k1  [RESC1608X55N]
R26  5k1  [RESC1608X55N]
R51  51R  [0402R]
R211  51R  [0402R]
R215  0  [RESC1608X55N]
R216  240  [RESC1608X55N]
R217  100  [RESC1608X55N]
R218  240  [RESC1608X55N]
R219  240  [RESC1608X55N]
R220  1k  [RESC1608X55N]
R221  1k  [RESC1608X55N]
R223  5k1  [RESC1608X55N]
R224  100  Mounted: No  [RESC1608X55N]
R245  dnp  Case: 0603  [RESC1608X55N]
R249  dnp  [RESC1608X55N]
R250  dnp  [RESC1608X55N]
R251  dnp  [RESC1608X55N]
R252  dnp  [RESC1608X55N]
R253  0  [RESC1608X55N]
R254  dnp  [RESC1608X55N]
R272  1k  [RESC1608X55N]
R315  5k1  [RESC1608X55N]
R316  5k1  [RESC1608X55N]
R317  5k1  [RESC1608X55N]

### Ports
BOOT_CLK_OUT (out), CLK20_VCXO (out), PLL_DAC1_SYNC_N (in), PLL_DAC2_SYNC_N (in), PLL_DAC_DIN (in), PLL_DAC_SCLK (in), SI57X_CLK_N (out), SI57X_CLK_P (out), SI57X_OE (in), SI57X_SCL (in), SI57X_SDA (bidir), SI57X_TUNE (in), WR_PLL_CLK1_N (out), WR_PLL_CLK1_P (out)

### Nets
GND: C416.1 C417.2 C418.1 C419.1 C420.1 C421.2 C422.2 C423.1 C424.2 C425.2 C426.1 C427.2 C428.1 C429.2 C430.2 C431.2 C432.2 C433.2 C434.2 C452.2 C453.1 C455a.1 C455b.1 C468.1 C584.2 C749.2 C750.2 C763.2 C765.1 C767.2 IC48.2(GND) IC48.4(GND) IC50.22(GND1) IC50.33(EP) IC51.2(GND) IC52.8(GND) IC53.8(GND) IC54.3(A) J5.2 J5.2a(GND) OSC1.3(GND) OSC2.3(GND) OSC4.3(GND) OSC5.2(GND) Q8.2(S) R26.1 R211.2 R215.1 R217.1 R245.1 R249.1 R250.1 R251.1 R252.1 R253.1 R254.1
P3V3: L13.1 R25.1 R220.2 R223.2 R272.2
P3V3_CLEAN: C428.2 C429.1 C430.1 C431.1 C432.1 C433.1 C434.1 C455a.2 C455b.2 C468.2 C584.1 C749.1 C750.1 C767.1 IC48.7(VCC) IC50.1(VCCOUT) IC50.4(VCCOUT) IC50.7(CE) IC50.9(VCCVCO) IC50.20(VCCIN) IC50.27(VCCOUT) IC50.30(VCCOUT) IC51.1(VIN) IC51.3(EN) IC52.1(VDD) IC53.1(VDD) L9.2 L13.2 L21.2 OSC2.2(E/D) OSC2.6(+VS) R219.1 R317.2
CLK20_VCXO: R217.2 R221.1 ; port CLK20_VCXO
GND_RP0: IC50.12(~{RSTN}) R245.2
GND_RP1: IC50.25(PR0) R249.2
GND_RP2: IC50.26(PR1) R250.2
GND_RP3: IC50.13(OD0) R251.2
GND_RP4: IC50.14(OD1) R252.2
GND_RP5: IC50.15(OD2) R215.2
GND_RP6: IC50.10(OS1) R253.2
GND_RP7: IC50.11(OS0) R254.2
P3V3_L9: C426.2 C427.1 L9.1 OSC4.6(VDD)
PLLDAC_OUT1: C422.1 OSC1.1(VCO) OSC5.1(VC) R218.2
PLLDAC_OUT1_R: IC53.3(VFB) IC53.4(VOUT) R218.1
PLLDAC_OUT2: C421.1 OSC2.1(VCTRL) R216.2
PLLDAC_OUT2_R: IC52.3(VFB) IC52.4(VOUT) R216.1
REGCAP1: C419.2 IC50.19(REGCAP1)
REGCAP2: C420.2 IC50.17(REGCAP2)
SI57X_CLK_N: IC48.5(~{Q}) OSC4.5(CLK-) ; port SI57X_CLK_N
SI57X_CLK_P: IC48.6(Q) OSC4.4(CLK+) ; port SI57X_CLK_P
SI_TUNE_R: C425.1 OSC4.1(NC) R224.1
VCC_PLL: C452.1 C453.2 IC50.16(VCCPLL2) IC50.18(VCCPLL1) L21.1
VCXO_R: OSC2.4(OUT) R51.1 R221.2
VOUT_3V0: C416.2 C417.1 C418.2 IC51.5(VOUT) OSC1.6(VDD) OSC5.4(+Vs)
VREF2V5_WR: C423.2 C424.1 IC52.2(VREF) IC53.2(VREF) IC54.1(I/O) IC54.2(REF) R219.2
WR_PLL_CLK1_N: IC50.5(OUTN0) ; port WR_PLL_CLK1_N
WR_PLL_CLK1_P: IC50.6(OUTP0) ; port WR_PLL_CLK1_P
XIN: C415.1 OSC1.4(OUT) OSC5.3(OUT)
XINC: C415.2 IC50.21(XIN)
NetC763_1: C763.1 R25.2 R26.2 R315.1 R316.1
NetC764_1: C764.1 J5.1 R211.1
NetC764_2: C764.2 IC48.8(IN) R315.2
NetC765_2: C765.2 IC48.1(IN) R316.2
NetIC48_3: IC48.3(EN) Q8.3(D) R317.1
NetIC52_5: IC52.5(~{SYNC}) ; port PLL_DAC2_SYNC_N
NetIC52_6: IC52.6(SCLK) IC53.6(SCLK) ; port PLL_DAC_SCLK
NetIC52_7: IC52.7(DIN) IC53.7(DIN) ; port PLL_DAC_DIN
NetIC53_5: IC53.5(~{SYNC}) ; port PLL_DAC1_SYNC_N
NetOSC4_2: OSC4.2(OE) Q8.1(G) R223.1 ; port SI57X_OE
NetOSC4_7: OSC4.7(SDA) R272.1 ; port SI57X_SDA
NetOSC4_8: OSC4.8(SCL) R220.1 ; port SI57X_SCL
NetR51_2: R51.2 ; port BOOT_CLK_OUT
NetR224_2: R224.2 ; port SI57X_TUNE

Not connected (* = marked no-connect by the designer): IC50 2(OUTN1)* 3(OUTP1)* 8(NC) 23(OSCOUT)* 24(NC) 28(OUTN3)* 29(OUTP3)* 31(OUTN2)* 32(OUTP2)*; IC51 4(NC); OSC2 5(N/C)

### Layout directives
differential pair: SI57X_CLK_N, SI57X_CLK_P, WR_PLL_CLK1_N, WR_PLL_CLK1_P
net class DE_SIG: CLK20_VCXO, VCXO_R, XIN, XINC
net class SE50: CLK20_VCXO, VCXO_R, XIN, XINC
net class POWER: P3V3_CLEAN, P3V3_L9, VCC_PLL, VOUT_3V0, VREF2V5_WR

### Notes on the sheet
- Copyright CERN 2011.
  This documentation describes Open Hardware and is licensed under the CERN OHL v. 1.1. You may redistribute and modify this documentation under the terms of the CERN OHL v.1.1. (http://ohwr.org/CERNOHL). This documentation is distributed WITHOUT ANY EXPRESS OR IMPLIED WARRANTY, INCLUDING OF MERCHANTABILITY, SATISFACTORY QUALITY AND FITNESS FOR A PARTICULAR PURPOSE. Please see the CERN OHL v.1.1 for applicable conditions.
- CDCM61004 configuration:
  LVDS outputs
  PRESC DIV = 4
  FB DIV = 20
  OUT DIV = 4
  All config inputs have internal pull-ups.
  Input = 25 MHz
  Output=125 MHz
- (near OSC5) Control voltage is +1.5V ±1V.
  Min. pull range is ±10 ppm for ±1V.
  Positive slope (Positive voltage for positive frequency shift).
- (near OSC2) Vc 1.65V +/- 1.65V
- DAC Vih = 2V so it accepts 2.5V CMOS signal
- DAC ouput range: 0V to 2.5V
- (near IC54) Changed LM336M-2.5/NOPB to TL431QDBVT... now we have propper 2.5V
- (near R224) Optional RC filter for 1-bit DAC from FPGA output.
  Can be used to fine tune Si571, which has a control voltage input.
- (in symbol L_CHOKE_ELLVGG) 1uH, 2.2A, 52mR Panasonic
- (in symbol R0603_0R_JUMPER) 1%
- (in symbol R0603_1K_1%_0.1W_100PPM) 1%
- (in symbol R0603_5K1_1%_0.1W_100PPM) 1%
- (in symbol R0603_100R_1%_0.1W_100PPM) 1%
- (in symbol R0603_240R_1%_0.1W_100PPM) 1%

### Library data of the parts
C415 C417 C418 C421 C422 C424 C425 C427-C434 C452 C584 C749 C750 C763-C765 C767 = CAP_SMD_0201: Capacitor SMD
C416 C426 C468 = CC0603_1UF_16V_10%_X7R: Non-polarised capacitor; Part Description: SMD Multilayer Chip Ceramic Capacitor; Manufacturer: GENERIC; Manufacturer1 Part Number: 223824613663; Value: 1uF; Voltage: 16V; TC: X7R; Tolerance: ±10%; Table: Capacitors SMD; Part Number: CC0603_1UF_16V_10%_X7R; Component Kind: Standard; Component Type: Standard; Pin Count: 2; Status: Preferred; Manufacturer Part Number: CC0603_1uF_16V_10%_X7R; Case: 0603; Mounted: Yes; Socket: No; SMD: Yes; Manufacturer1 Example: PHYCOMP; Manufacturer1 ComponentHeight: 0.87mm; HelpURL: \\cern.ch\dfs\Applications\Altium\Datasheets\CC0805_X5R_PHYCOMP_HC.pdf; Author: CERN DEM JLC; CreateDate: 03/12/2007; LatestRevisionDate: 03/12/2007
C419 C420 C423 = CC1206_22UF_10V_10%_X7R: Non-polarised capacitor; Part Description: SMD Multilayer Chip Ceramic Capacitor; Manufacturer: GENERIC; Manufacturer1 Part Number: GRM31CR71A226KE15L; Value: 22uF; Voltage: 10V; TC: X7R; Tolerance: ±10%; Table: Capacitors SMD; Part Number: CC1206_22UF_10V_10%_X7R; Component Kind: Standard; Component Type: Standard; Pin Count: 2; Status: Preferred; Manufacturer Part Number: CC1206_22UF_10V_10%_X7R; Case: 1206; Mounted: Yes; Socket: No; SMD: Yes; Manufacturer1 Example: MURATA; Manufacturer1 ComponentHeight: 1.8mm; HelpURL: \\cern.ch\dfs\Applications\Altium\Datasheets\CC1206_X7R_MURATA_GRM-HI-CAP.pdf; Author: CERN DEM JLC; CreateDate: 2010-06-08; LatestRevisionDate: 2010-06-08
C453 = CC0603_1UF_16V_10%_X7R: Non-polarised capacitor; Part Description: SMD Multilayer Chip Ceramic Capacitor; Manufacturer: GENERIC; Manufacturer1 Part Number: 223824613663; Manufacturer1 Datasheet: \\cern.ch\dfs\Applications\Altium\Datasheets\CC0805_X5R_PHYCOMP_HC.pdf; Value: 1uF; Voltage: 16V; TC: X7R; Tolerance: ±10%; Table: Capacitors SMD; Part Number: CC0603_1UF_16V_10%_X7R; Component Kind: Standard; Component Type: Standard; Designator: Capacitor - non polarized; Library Reference: Capacitor - non polarized; Pin Count: 2; Status: Preferred; Manufacturer Part Number: CC0603_1uF_16V_10%_X7R; Case: 0603; Mounted: Yes; Socket: No; SMD: Yes; Manufacturer1 Example: PHYCOMP; Manufacturer1 ComponentHeight: 0.87mm; HelpURL: \\cern.ch\dfs\Applications\Altium\Datasheets\CC0805_X5R_PHYCOMP_HC.pdf; Author: CERN DEM JLC; CreateDate: 03/12/2007; LatestRevisionDate: 03/12/2007
C455a C455b = Ceramic_0805: MiscInfo: Biggest Cern Footprint [max height]; Document Name: Clock_WR.SchDoc; Part Number: Ceramic_0805; FootprintSizeX (mm): 3.5; FootprintSizeY (mm): 2; FootprintRectangleArea (mm): 7; Thickness (Max) (mm): 1.4; FootprintAlias: 0805
IC48 = IFC_FIN1101K8X: LVDS TO LVDS repeater3.3V
IC50 = CDCM61004RHBT: Four Output, Integrated VCO, Low-Jitter Clock Generator; Manufacturer: TEXAS INSTRUMENTS; Table: Analog & Interface; Part Number: CDCM61004RHBT; Component Kind: Standard; Component Type: Standard; Device: CDCM61004RHBT; PackageDescription: QFN, (MO-220-VHHD-4) 0.50mm pitch,square; 8 pin X 8 pin, 5mm X 5mm X 1.00mm H body (w/thermal tab 3.5 X 3.5mm),  IPC Medium Density; Part Description: Four Output, Integrated VCO, Low-Jitter Clock Generator; Manufacturer Part Number: CDCM61004RHBT; Pin Count: 33; Case: QFN32; Mounted: Yes; Socket: No; SMD: Yes; ComponentHeight: 1mm; Author: CERN DEM JLC; HelpURL: \\cern.ch\dfs\Applications\Altium\Datasheets\CDCM61004RHBT.pdf; CreateDate: 2010-08-25; LatestRevisionDate: 2010-08-25
IC51 = LP5951MF-3.0/NOPB: 150mA Micropower Low-Dropout CMOS Voltage Regulator; Part Description: 3V,  150mA Micropower Low-Dropout CMOS Voltage Regulator; Manufacturer: NATIONAL SEMICONDUCTOR; Table: Regulators; Part Number: LP5951MF-3.0/NOPB; Component Kind: Standard; Component Type: Standard; Device: LP5951MF-3.0/NOPB; PackageDescription: SOT23 5, Pitch 0.95mm - Body 1.67x2.99mm, IPC Medium Density; Manufacturer Part Number: LP5951MF-3.0/NOPB; Pin Count: 5; Case: SOT23-5; Mounted: Yes; Socket: No; SMD: Yes; ComponentHeight: 1.19mm; HelpURL: \\cern.ch\dfs\Applications\Altium\Datasheets\LP5951MF-3.0-NOPB.pdf; Author: CERN DEM JLC; CreateDate: 24/01/2011; LatestRevisionDate: 24/01/2011
IC52 IC53 = AD5662BRMZ-1: 2.7V to 5.5V, 250uA, Rail-to-Rail Output 16-Bit nanoDAC; Manufacturer: ANALOG DEVICES; Table: Analog & Interface; Part Number: AD5662BRMZ-1; Component Kind: Standard; Component Type: Standard; Device: AD5662BRMZ-1; PackageDescription: SOP, 8-Leads, Body 3.0x3.0mm, Pitch 0.65mm, IPC Medium Density; Part Description: 2.7V to 5.5V, 250uA, Rail-to-Rail Output 16-Bit nanoDAC; Manufacturer Part Number: AD5662BRMZ-1; Pin Count: 8; Case: MSOP8; Mounted: Yes; Socket: No; SMD: Yes; ComponentHeight: 1.1mm; Author: CERN DEM JLC; HelpURL: \\cern.ch\dfs\Applications\Altium\Datasheets\AD5662BRMZ-1.pdf; CreateDate: 1/10/2011; LatestRevisionDate: 1/10/2011
IC54 = REF_TL431_SOT23: 2.5V ADJ Voltage reference
J5 = CON_UFL_SMD: UFL; Supplier 1: Newark; Supplier Part Number 1: 50P8856
L9 L21 = IND0805_MURATA_BLM21PG221SN1D: Inductor; Part Description: SMD EMIFIL Suppression Chip Bead Ferrite; Manufacturer: MURATA; Power: 2A; Resistance: 0.05R; Tolerance: ±25%; Table: Inductors SMD; Part Number: IND0805_MURATA_BLM21PG221SN1D; Component Kind: Standard; Component Type: Standard; Pin Count: 2; Value: 220R@100MHz; Status: None; Manufacturer Part Number: BLM21PG221SN1D; Case: 0805; Mounted: Yes; Socket: No; SMD: Yes; ComponentHeight: 1.05mm; HelpURL: \\cern.ch\dfs\Applications\Altium\Datasheets\IND0402_MURATA_BLM21P.pdf; Author: CERN DEM JLC; CreateDate: 25/01/2010; LatestRevisionDate: 25/01/2010
L13 = L_CHOKE_ELLVGG: 2.2uH, 1.4A, 92mR Panasonic
OSC1 = OSC_25MHZ_RAKON_IVT3205CR: Oscillator 4 pins 1=VCO 3=GND 4=OUT 6=VDC; Part Description: 11pF 3.3V ±1ppm Surface Mount TCXO Voltage Controlled Oscillator (IT3200C Serie); Manufacturer: RAKON; Table: Crystals & Oscillators; Part Number: OSC_25MHZ_RAKON_IVT3205CR; Component Kind: Standard; Component Type: Standard; PackageDescription: Oscillator IVT3200C Serie, corner concave; 4 pin, 2.50mm L X 3.2mm W X 1.1mm H; Value: 25MHz; Pin Count: 4; Socket: No; SMD: Yes; ComponentHeight: 1.1mm; HelpURL: \\cern.ch\dfs\Applications\Altium\Datasheets\OSC_RAKON_IVT3200C.pdf; Author: CERN DEM JLC; CreateDate: 08/02/2010; LatestRevisionDate: 08/02/2010
OSC2 = OSC_20MHZ_IQD_LF VCXO026156: 3.3V ±100ppm 15pF HCMOS Tri-State Surface Mount Voltage Controlled Oscillator VCXO (CFPV-45 Serie); Manufacturer: IQD FREQUENCY PRODUCTS; Table: Crystals & Oscillators; Part Number: OSC_20MHZ_IQD_LF VCXO026156; Component Kind: Standard; Component Type: Standard; PackageDescription: SMD VCXO, side convave, 6 pins, 5.00x7.00mm (CFPV-45 Serie); Value: 20MHz; Part Description: 3.3V ±100ppm 15pF HCMOS Tri-State Surface Mount Voltage Controlled Oscillator VCXO (CFPV-45 Serie); Pin Count: 6; Mounted: Yes; Socket: No; SMD: Yes; ComponentHeight: 1.7mm; HelpURL: \\cern.ch\dfs\Applications\Altium\Datasheets\OSC_IQD_CFPV-45.pdf; Author: CERN DEM JLC; CreateDate: 1/24/2011; LatestRevisionDate: 1/24/2011
OSC4 = OSC_10-280MHZ_SILICON-LAB_Si570BBC000121DG: Any-Rate I2C Programmable XO Oscillator Si570 Serie; Part Description: 10-280MHz 3.3V ±20ppm LVDS Any-Rate I2C Programmable XO Oscillator Si570 Serie; Manufacturer: SILICON LABS; Table: Crystals & Oscillators; Part Number: OSC_10-280MHZ_SILICON-LAB_Si570BBC000121DG; Component Kind: Standard; Component Type: Standard; PackageDescription: Oscillator Si570 Serie, 8 pins, 5x7mm; Value: 10-280MHz; Pin Count: 8; Mounted: Yes; Socket: No; SMD: Yes; ComponentHeight: 1.85mm; HelpURL: \\cern.ch\dfs\Applications\Altium\Datasheets\OSC_SILICON-LAB_SI570.pdf; Author: CERN DEM JLC; CreateDate: 2/9/2010; LatestRevisionDate: 2/9/2010
OSC5 = OSC_25MHZ_MERCURY_VM53S3-25.000-2.5/-30+75: Oscillator 4 pins 1=VC 2=GND 3=OUT 4=+Vs; Part Description: 3V ±2.5ppmVoltage Controlled Temperature Compensated Crystal Oscillator VM53S3 Serie; Manufacturer: MERCURY ELECTRONICS; Table: Crystals & Oscillators; Part Number: OSC_25MHZ_MERCURY_VM53S3-25.000-2.5/-30+75; Component Kind: Standard; Component Type: Standard; PackageDescription: SMD Oscillator, Corner Convave, 4 pins, 5x3.2mm; Value: 25MHz; Pin Count: 4; Socket: No; SMD: Yes; ComponentHeight: 1.6mm; HelpURL: \\cern.ch\dfs\Applications\Altium\Datasheets\OSC_MERCURY_VM53S3.pdf; Author: CERN DEM JLC; CreateDate: 1/20/2010; LatestRevisionDate: 1/24/2011
Q8 = Q_BSS138
R25 R26 R223 R315-R317 = R0603_5K1_1%_0.1W_100PPM: Resistor - 1%; Part Description: General Purpose Thick Film Chip Resistor; Manufacturer: GENERIC; Manufacturer1 Part Number: NRC06F5101TRF; Power: 0.1W; TC: ±100ppm/°C; Table: Resistors SMD; Part Number: R0603_5K1_1%_0.1W_100PPM; Component Kind: Standard; Component Type: Standard; Pin Count: 2; Value: 5k1; Status: Preferred; Tolerance: ±1%; Manufacturer Part Number: R0603_5K1_1%_0.1W_100PPM; Case: 0603; Mounted: Yes; Socket: No; SMD: Yes; Manufacturer1 Example: NIC COMPONENT; Manufacturer1 ComponentHeight: 0.55mm; HelpURL: \\cern.ch\dfs\Applications\Altium\Datasheets\R0603_NIC_NRC.pdf; Author: CERN DEM JLC; CreateDate: 03/12/2007; LatestRevisionDate: 13/03/2008
R51 R211 = RES_0402: SMD Resistor; Supplier 1: Newark; Supplier Part Number 1: 59M6691
R215 R253 = R0603_0R_JUMPER: Resistor - 1%; Part Description: 1A (0.05R Max DC Resistance) Zero Ohm Jumper; Manufacturer: GENERIC; Manufacturer1 Part Number: NRC06Z0; Table: Resistors SMD; Part Number: R0603_0R_JUMPER; Component Kind: Standard; Component Type: Standard; Pin Count: 2; Value: 0; Status: Preferred; Manufacturer Part Number: R0603_0R_JUMPER; Case: 0603; Socket: No; SMD: Yes; Manufacturer1 Example: NIC COMPONENT; Manufacturer1 ComponentHeight: 0.55mm; HelpURL: \\cern.ch\dfs\Applications\Altium\Datasheets\R0603_NIC_NRC.pdf; Author: CERN DEM JLC; CreateDate: 2007-12-03; LatestRevisionDate: 2008-03-13
R216 R218 R219 = R0603_240R_1%_0.1W_100PPM: Resistor - 1%; Part Description: General Purpose Thick Film Chip Resistor; Manufacturer: GENERIC; Manufacturer1 Part Number: NRC06F2400TRF; Power: 0.1W; TC: ±100ppm/°C; Table: Resistors SMD; Part Number: R0603_240R_1%_0.1W_100PPM; Component Kind: Standard; Component Type: Standard; Pin Count: 2; Value: 240; Status: Preferred; Tolerance: ±1%; Manufacturer Part Number: R0603_240R_1%_0.1W_100PPM; Case: 0603; Mounted: Yes; Socket: No; SMD: Yes; Manufacturer1 Example: NIC COMPONENT; Manufacturer1 ComponentHeight: 0.55mm; HelpURL: \\cern.ch\dfs\Applications\Altium\Datasheets\R0603_NIC_NRC.pdf; Author: CERN DEM JLC; CreateDate: 12/3/2007; LatestRevisionDate: 3/13/2008
R217 R224 = R0603_100R_1%_0.1W_100PPM: Resistor - 1%; Part Description: General Purpose Thick Film Chip Resistor; Manufacturer: GENERIC; Manufacturer1 Part Number: NRC06F4700TRF; Power: 0.1W; TC: ±100ppm/°C; Table: Resistors SMD; Part Number: R0603_100R_1%_0.1W_100PPM; Component Kind: Standard; Component Type: Standard; Pin Count: 2; Value: 100; Status: Preferred; Tolerance: ±1%; Manufacturer Part Number: R0603_100R_1%_0.1W_100PPM; Case: 0603; Socket: No; SMD: Yes; Manufacturer1 Example: NIC COMPONENT; Manufacturer1 ComponentHeight: 0.55mm; HelpURL: \\cern.ch\dfs\Applications\Altium\Datasheets\R0603_NIC_NRC.pdf; Author: CERN DEM JLC; CreateDate: 12/3/2007; LatestRevisionDate: 3/13/2008
  R217: Mounted: Yes
R220 R221 R272 = R0603_1K_1%_0.1W_100PPM: Resistor - 1%; Part Description: General Purpose Thick Film Chip Resistor; Manufacturer: GENERIC; Manufacturer1 Part Number: NRC06F1001TRF; Power: 0.1W; TC: ±100ppm/°C; Table: Resistors SMD; Part Number: R0603_1K_1%_0.1W_100PPM; Component Kind: Standard; Component Type: Standard; Pin Count: 2; Value: 1k; Status: Preferred; Tolerance: ±1%; Manufacturer Part Number: R0603_1K_1%_0.1W_100PPM; Case: 0603; Mounted: Yes; Socket: No; SMD: Yes; Manufacturer1 Example: NIC COMPONENT; Manufacturer1 ComponentHeight: 0.55mm; HelpURL: \\cern.ch\dfs\Applications\Altium\Datasheets\R0603_NIC_NRC.pdf; Author: CERN DEM JLC; CreateDate: 12/3/2007; LatestRevisionDate: 3/13/2008
R245 R249-R252 R254 = R0603_0R_JUMPER: Resistor - 1%; Part Description: 1A (0.05R Max DC Resistance) Zero Ohm Jumper; Manufacturer: GENERIC; Manufacturer1 Part Number: NRC06Z0; Value: 0; Table: Resistors SMD; Part Number: R0603_0R_JUMPER; Component Kind: Standard; Component Type: Standard; Pin Count: 2; Status: Preferred; Manufacturer Part Number: R0603_0R_JUMPER; Socket: No; SMD: Yes; Manufacturer1 Example: NIC COMPONENT; Manufacturer1 ComponentHeight: 0.55mm; HelpURL: \\cern.ch\dfs\Applications\Altium\Datasheets\R0603_NIC_NRC.pdf; Author: CERN DEM JLC; CreateDate: 2007-12-03; LatestRevisionDate: 2008-03-13
  R249-R252 R254: Case: 0603

## Sheet FMC_Clocks.SchDoc
size A4; DocumentNumber: 27; SheetNumber: 27; SheetTotal: 30
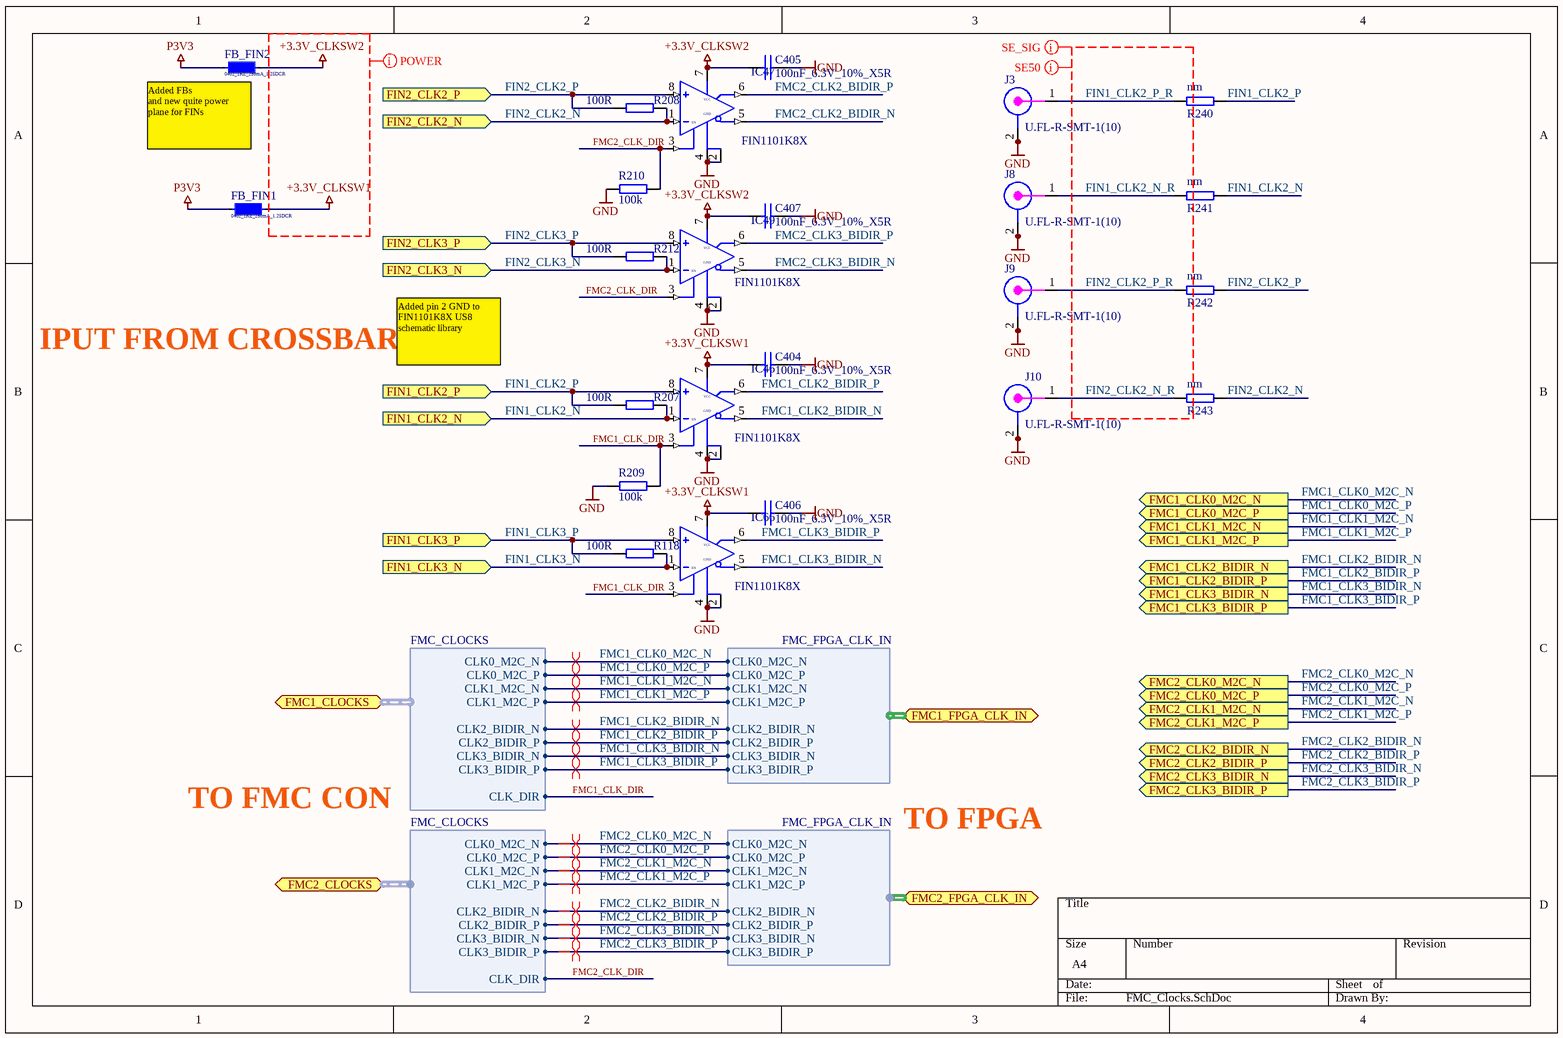
[diagram p20: FMC_Clocks.SchDoc]

### Parts
C404  100nF_6.3V_10%_X5R  [0201C]
C405  100nF_6.3V_10%_X5R  [0201C]
C406  100nF_6.3V_10%_X5R  [0201C]
C407  100nF_6.3V_10%_X5R  [0201C]
FB_FIN1  0402_1KZ_250mA_1.25DCR  [INDC1005X55N]
FB_FIN2  0402_1KZ_250mA_1.25DCR  [INDC1005X55N]
IC46  FIN1101K8X  [US8]
IC47  FIN1101K8X  [US8]
IC49  FIN1101K8X  [US8]
IC66  FIN1101K8X  [US8]
J3  U.FL-R-SMT-1(10)  [CON_UFL_HIROSE_RECEPTACLE]
J8  U.FL-R-SMT-1(10)  [CON_UFL_HIROSE_RECEPTACLE]
J9  U.FL-R-SMT-1(10)  [CON_UFL_HIROSE_RECEPTACLE]
J10  U.FL-R-SMT-1(10)  [CON_UFL_HIROSE_RECEPTACLE]
R118  100R  [0402R]
R207  100R  [0402R]
R208  100R  [0402R]
R209  100k  [0402R]
R210  100k  [0402R]
R212  100R  [0402R]
R240  nm  [0402R]
R241  nm  [0402R]
R242  nm  [0402R]
R243  nm  [0402R]

### Ports
FIN1_CLK2_N (in), FIN1_CLK2_P (in), FIN1_CLK3_N (in), FIN1_CLK3_P (in), FIN2_CLK2_N (in), FIN2_CLK2_P (in), FIN2_CLK3_N (in), FIN2_CLK3_P (in), FMC1_CLK0_M2C_N (out), FMC1_CLK0_M2C_P (out), FMC1_CLK1_M2C_N (out), FMC1_CLK1_M2C_P (out), FMC1_CLK2_BIDIR_N (out), FMC1_CLK2_BIDIR_P (out), FMC1_CLK3_BIDIR_N (out), FMC1_CLK3_BIDIR_P (out), FMC1_CLOCKS (harness FMC_CLOCKS), FMC1_FPGA_CLK_IN (harness FMC_FPGA_CLK_IN), FMC2_CLK0_M2C_N (out), FMC2_CLK0_M2C_P (out), FMC2_CLK1_M2C_N (out), FMC2_CLK1_M2C_P (out), FMC2_CLK2_BIDIR_N (out), FMC2_CLK2_BIDIR_P (out), FMC2_CLK3_BIDIR_N (out), FMC2_CLK3_BIDIR_P (out), FMC2_CLOCKS (harness FMC_CLOCKS), FMC2_FPGA_CLK_IN (harness FMC_FPGA_CLK_IN)

### Harnesses
FMC_CLOCKS: CLK0_M2C_N, CLK0_M2C_P, CLK1_M2C_N, CLK1_M2C_P, CLK_DIR, CLK2_BIDIR_N, CLK2_BIDIR_P, CLK3_BIDIR_N, CLK3_BIDIR_P
FMC_FPGA_CLK_IN: CLK0_M2C_N, CLK0_M2C_P, CLK1_M2C_N, CLK1_M2C_P, CLK2_BIDIR_N, CLK2_BIDIR_P, CLK3_BIDIR_N, CLK3_BIDIR_P

### Nets
+3.3V_CLKSW1: C404.1 C406.1 FB_FIN1.2(-) IC46.7(VCC) IC66.7(VCC)
+3.3V_CLKSW2: C405.1 C407.1 FB_FIN2.2(-) IC47.7(VCC) IC49.7(VCC)
GND: C404.2 C405.2 C406.2 C407.2 IC46.2(GND) IC46.4(GND) IC47.2(GND) IC47.4(GND) IC49.2(GND) IC49.4(GND) IC66.2(GND) IC66.4(GND) J3.2 J3.2a(GND) J8.2 J8.2a(GND) J9.2 J9.2a(GND) J10.2 J10.2a(GND) R209.1 R210.1
P3V3: FB_FIN1.1(+) FB_FIN2.1(+)
FIN1_CLK2_N: IC46.1(IN) R207.1 R241.1 ; port FIN1_CLK2_N
FIN1_CLK2_N_R: J8.1 R241.2
FIN1_CLK2_P: IC46.8(IN) R207.2 R240.1 ; port FIN1_CLK2_P
FIN1_CLK2_P_R: J3.1 R240.2
FIN1_CLK3_N: IC66.1(IN) R118.1 ; port FIN1_CLK3_N
FIN1_CLK3_P: IC66.8(IN) R118.2 ; port FIN1_CLK3_P
FIN2_CLK2_N: IC47.1(IN) R208.1 R243.1 ; port FIN2_CLK2_N
FIN2_CLK2_N_R: J10.1 R243.2
FIN2_CLK2_P: IC47.8(IN) R208.2 R242.1 ; port FIN2_CLK2_P
FIN2_CLK2_P_R: J9.1 R242.2
FIN2_CLK3_N: IC49.1(IN) R212.1 ; port FIN2_CLK3_N
FIN2_CLK3_P: IC49.8(IN) R212.2 ; port FIN2_CLK3_P
FMC1_CLK0_M2C_N: port FMC1_CLK0_M2C_N, port FMC1_CLOCKS.CLK0_M2C_N, port FMC1_FPGA_CLK_IN.CLK0_M2C_N
FMC1_CLK0_M2C_P: port FMC1_CLK0_M2C_P, port FMC1_CLOCKS.CLK0_M2C_P, port FMC1_FPGA_CLK_IN.CLK0_M2C_P
FMC1_CLK1_M2C_N: port FMC1_CLK1_M2C_N, port FMC1_CLOCKS.CLK1_M2C_N, port FMC1_FPGA_CLK_IN.CLK1_M2C_N
FMC1_CLK1_M2C_P: port FMC1_CLK1_M2C_P, port FMC1_CLOCKS.CLK1_M2C_P, port FMC1_FPGA_CLK_IN.CLK1_M2C_P
FMC1_CLK2_BIDIR_N: IC46.5(~{Q}) ; port FMC1_CLK2_BIDIR_N, port FMC1_CLOCKS.CLK2_BIDIR_N, port FMC1_FPGA_CLK_IN.CLK2_BIDIR_N
FMC1_CLK2_BIDIR_P: IC46.6(Q) ; port FMC1_CLK2_BIDIR_P, port FMC1_CLOCKS.CLK2_BIDIR_P, port FMC1_FPGA_CLK_IN.CLK2_BIDIR_P
FMC1_CLK3_BIDIR_N: IC66.5(~{Q}) ; port FMC1_CLK3_BIDIR_N, port FMC1_CLOCKS.CLK3_BIDIR_N, port FMC1_FPGA_CLK_IN.CLK3_BIDIR_N
FMC1_CLK3_BIDIR_P: IC66.6(Q) ; port FMC1_CLK3_BIDIR_P, port FMC1_CLOCKS.CLK3_BIDIR_P, port FMC1_FPGA_CLK_IN.CLK3_BIDIR_P
FMC1_CLK_DIR: IC46.3(EN) IC66.3(EN) R209.2 ; port FMC1_CLOCKS.CLK_DIR
FMC2_CLK0_M2C_N: port FMC2_CLK0_M2C_N, port FMC2_CLOCKS.CLK0_M2C_N, port FMC2_FPGA_CLK_IN.CLK0_M2C_N
FMC2_CLK0_M2C_P: port FMC2_CLK0_M2C_P, port FMC2_CLOCKS.CLK0_M2C_P, port FMC2_FPGA_CLK_IN.CLK0_M2C_P
FMC2_CLK1_M2C_N: port FMC2_CLK1_M2C_N, port FMC2_CLOCKS.CLK1_M2C_N, port FMC2_FPGA_CLK_IN.CLK1_M2C_N
FMC2_CLK1_M2C_P: port FMC2_CLK1_M2C_P, port FMC2_CLOCKS.CLK1_M2C_P, port FMC2_FPGA_CLK_IN.CLK1_M2C_P
FMC2_CLK2_BIDIR_N: IC47.5(~{Q}) ; port FMC2_CLK2_BIDIR_N, port FMC2_CLOCKS.CLK2_BIDIR_N, port FMC2_FPGA_CLK_IN.CLK2_BIDIR_N
FMC2_CLK2_BIDIR_P: IC47.6(Q) ; port FMC2_CLK2_BIDIR_P, port FMC2_CLOCKS.CLK2_BIDIR_P, port FMC2_FPGA_CLK_IN.CLK2_BIDIR_P
FMC2_CLK3_BIDIR_N: IC49.5(~{Q}) ; port FMC2_CLK3_BIDIR_N, port FMC2_CLOCKS.CLK3_BIDIR_N, port FMC2_FPGA_CLK_IN.CLK3_BIDIR_N
FMC2_CLK3_BIDIR_P: IC49.6(Q) ; port FMC2_CLK3_BIDIR_P, port FMC2_CLOCKS.CLK3_BIDIR_P, port FMC2_FPGA_CLK_IN.CLK3_BIDIR_P
FMC2_CLK_DIR: IC47.3(EN) IC49.3(EN) R210.2 ; port FMC2_CLOCKS.CLK_DIR

### Layout directives
differential pair: FMC1_CLK0_M2C_N, FMC1_CLK0_M2C_P, FMC1_CLK1_M2C_N, FMC1_CLK1_M2C_P, FMC1_CLK2_BIDIR_N, FMC1_CLK2_BIDIR_P, FMC1_CLK3_BIDIR_N, FMC1_CLK3_BIDIR_P, FMC2_CLK0_M2C_N, FMC2_CLK0_M2C_P, FMC2_CLK1_M2C_N, FMC2_CLK1_M2C_P, FMC2_CLK2_BIDIR_N, FMC2_CLK2_BIDIR_P, FMC2_CLK3_BIDIR_N, FMC2_CLK3_BIDIR_P
net class SE_SIG: FIN1_CLK2_N_R, FIN1_CLK2_P_R, FIN2_CLK2_N_R, FIN2_CLK2_P_R
net class SE50: FIN1_CLK2_N_R, FIN1_CLK2_P_R, FIN2_CLK2_N_R, FIN2_CLK2_P_R
net class POWER: +3.3V_CLKSW1, +3.3V_CLKSW2

### Notes on the sheet
- (near FB_FIN2) Added FBs
  and new quite power plane for FINs
- IPUT FROM CROSSBAR
- Added pin 2 GND to FIN1101K8X US8 schematic library
- TO FMC CON
- TO FPGA

### Library data of the parts
C404-C407 = CAP_SMD_0201: Capacitor SMD
FB_FIN1 FB_FIN2 = BLM15HD102SN1D: FILTER CHIP 1000 OHM 250MA 0402; Manufacturer: Murata Electronics North America; Impedance @ Frequency: 1K Ohm @ 100MHz; DC Resistance (DCR): 1.25 Ohm Max; Filter Type: Differential Mode - Single; Document Name: FMC_Clocks.SchDoc; Part Number: BLM15HD102SN1D; ParamsList: 0402_1KZ_250mA_1.25DCR; Supplier 1: Digi-Key; Supplier Part Number 1: 490-4003-1-ND; Manufacturer Part Number: BLM15HD102SN1D; RoHS: RoHS Compliant; Category: Filters; Stock 1: 324163; Pricing 1: 1=0.42, 10=0.332, 50=0.2186, 100=0.1734, 250=0.1282, 500=0.09952, 1000=0.07842, 5000=0.05881 (USD); Current Rating: 250mA; Package / Case: 0402 (1005 Metric); Mounting Type: Surface Mount; Packaging: Cut Tape (CT); Height (Max): 0.022" (0.55mm); Size / Dimension: 0.039" L x 0.020" W (1.00mm x 0.50mm); ComponentLink1URL: http://search.murata.co.jp/Ceramy/image/img/PDF/ENG/L0110S0101BLM15H.pdf; ComponentLink1Description: http://search.murata.co.jp/Ceramy/image/img/PDF/ENG/L0110S0101BLM15H.pdf; FootprintSizeX (mm): 1.82; FootprintSizeY (mm): 0.92; FootprintRectangleArea (mm): 1.67; Thickness (Max) (mm): 0.55; FootprintAlias: 0402
IC46 IC47 IC49 IC66 = IFC_FIN1101K8X: LVDS TO LVDS repeater3.3V
J3 J8-J10 = CON_UFL_SMD: UFL; Supplier 1: Newark; Supplier Part Number 1: 50P8856
R118 R207-R210 R212 R240-R243 = RES_0402: SMD Resistor; Supplier 1: Newark; Supplier Part Number 1: 59M6691